# EAGLE schematic axiom_beta_power_board_v1.25.f59751f5 (EAGLE 7.7.0), part 1 of 2
Assembly variants: Beta, Min

## Sheet 1 of 14
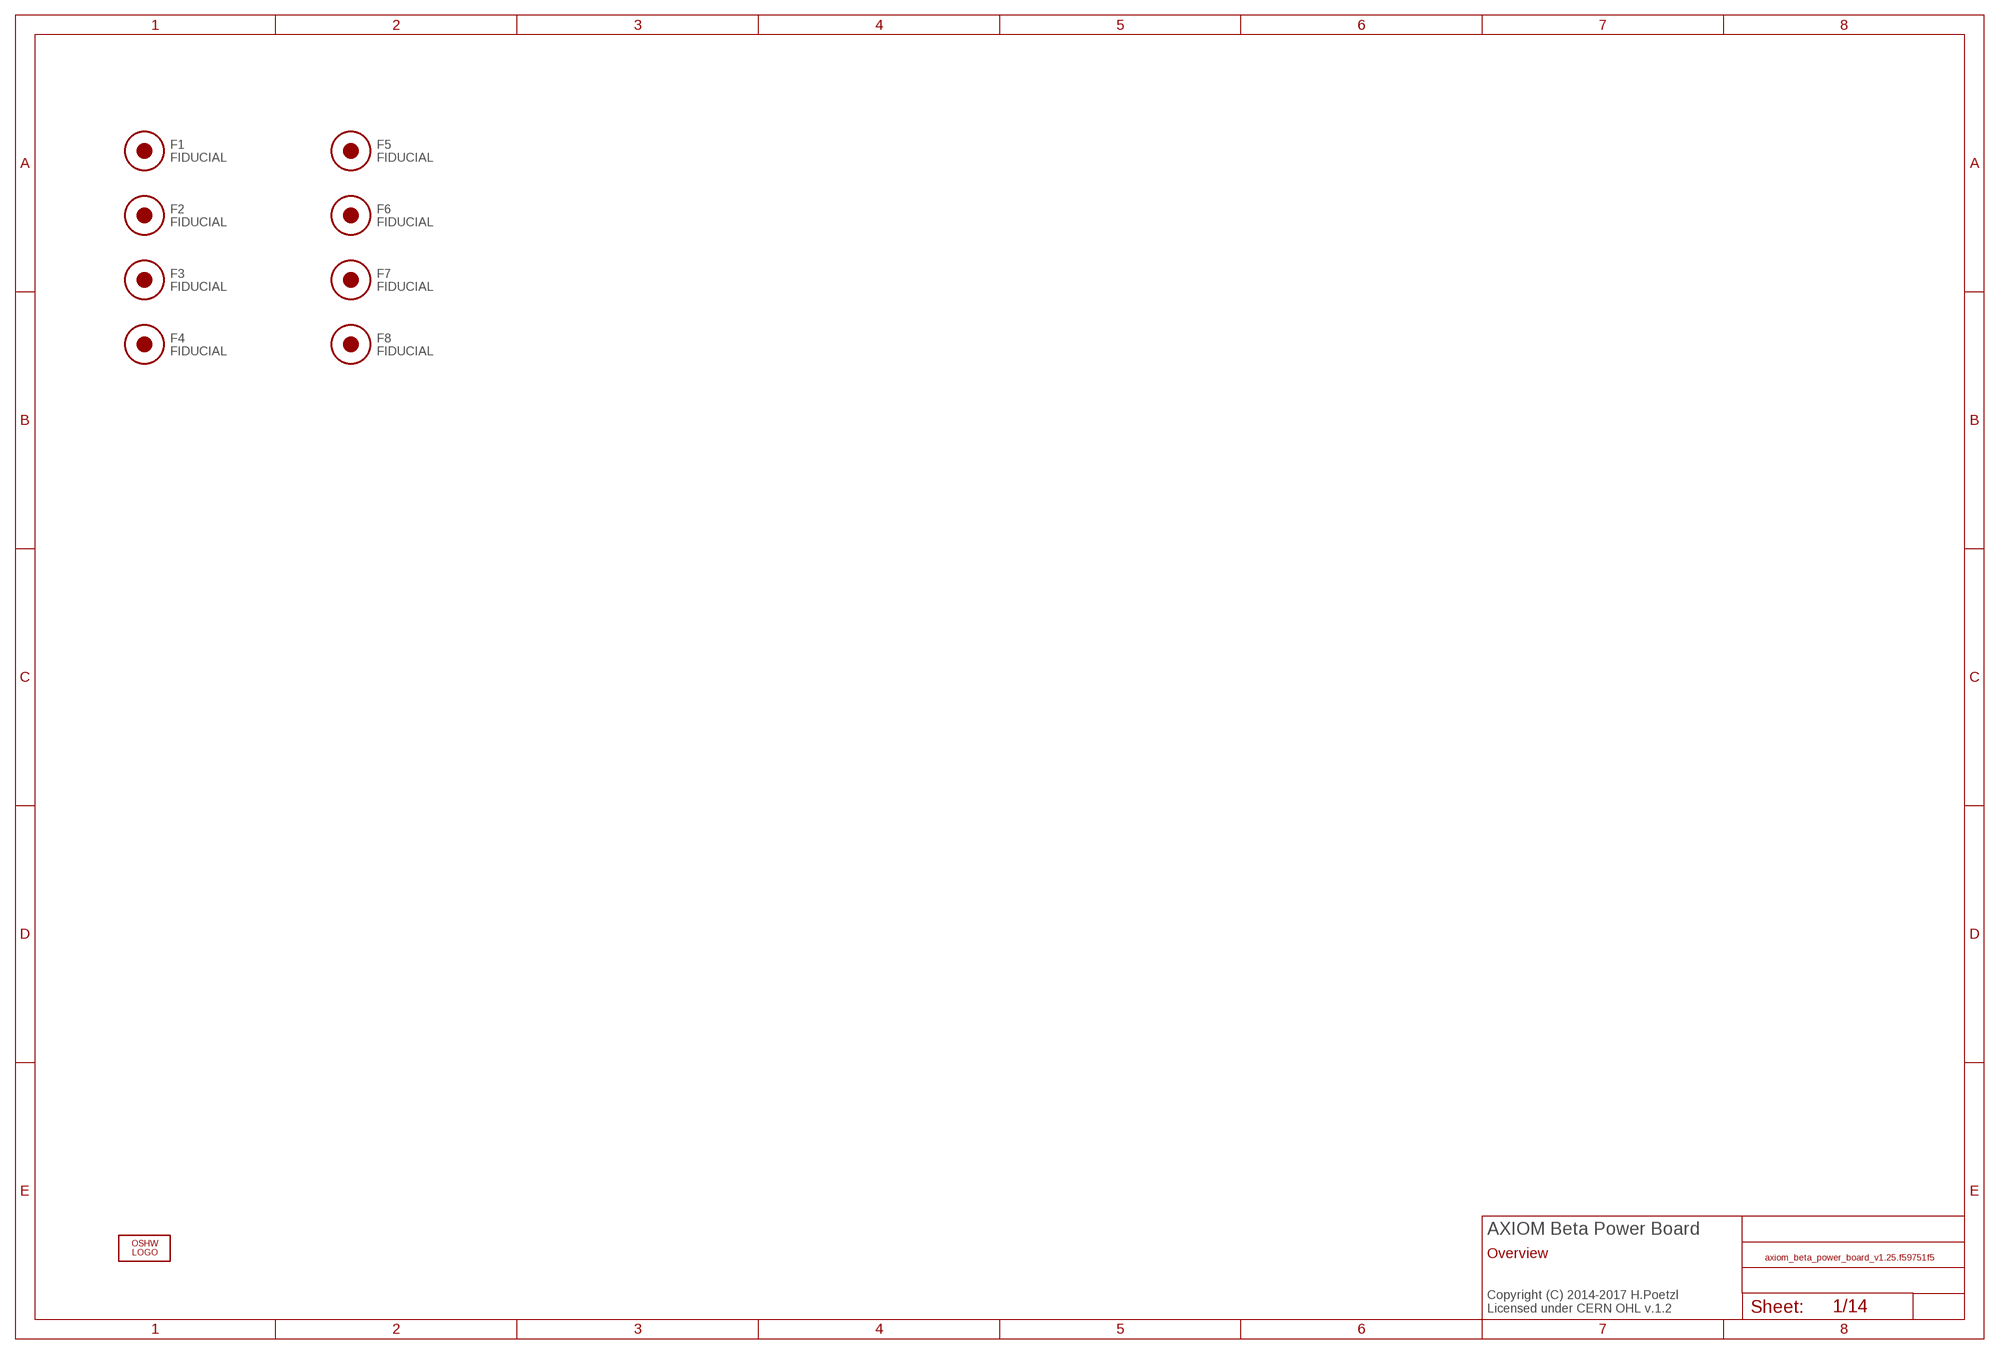
[diagram p0: schematic, sheet 1]

### Parts
F1  FIDUCIAL  [FID_ARROW]
F2  FIDUCIAL  [FID_ARROW]
F3  FIDUCIAL  [FID_ARROW]
F4  FIDUCIAL  [FID_ARROW]
F5  FIDUCIAL  [FID_ARROW]
F6  FIDUCIAL  [FID_ARROW]
F7  FIDUCIAL  [FID_ARROW]
F8  FIDUCIAL  [FID_ARROW]
LOGO2  OSHW_LOGO_FILLX0100-NT  [OSHW_FILLX100_NOTEXT]

### Notes on the sheet
- AXIOM Beta Power Board
- Overview
- Copyright (C) 2014-2017 H.Poetzl
  Licensed under CERN OHL v.1.2

## Sheet 2 of 14
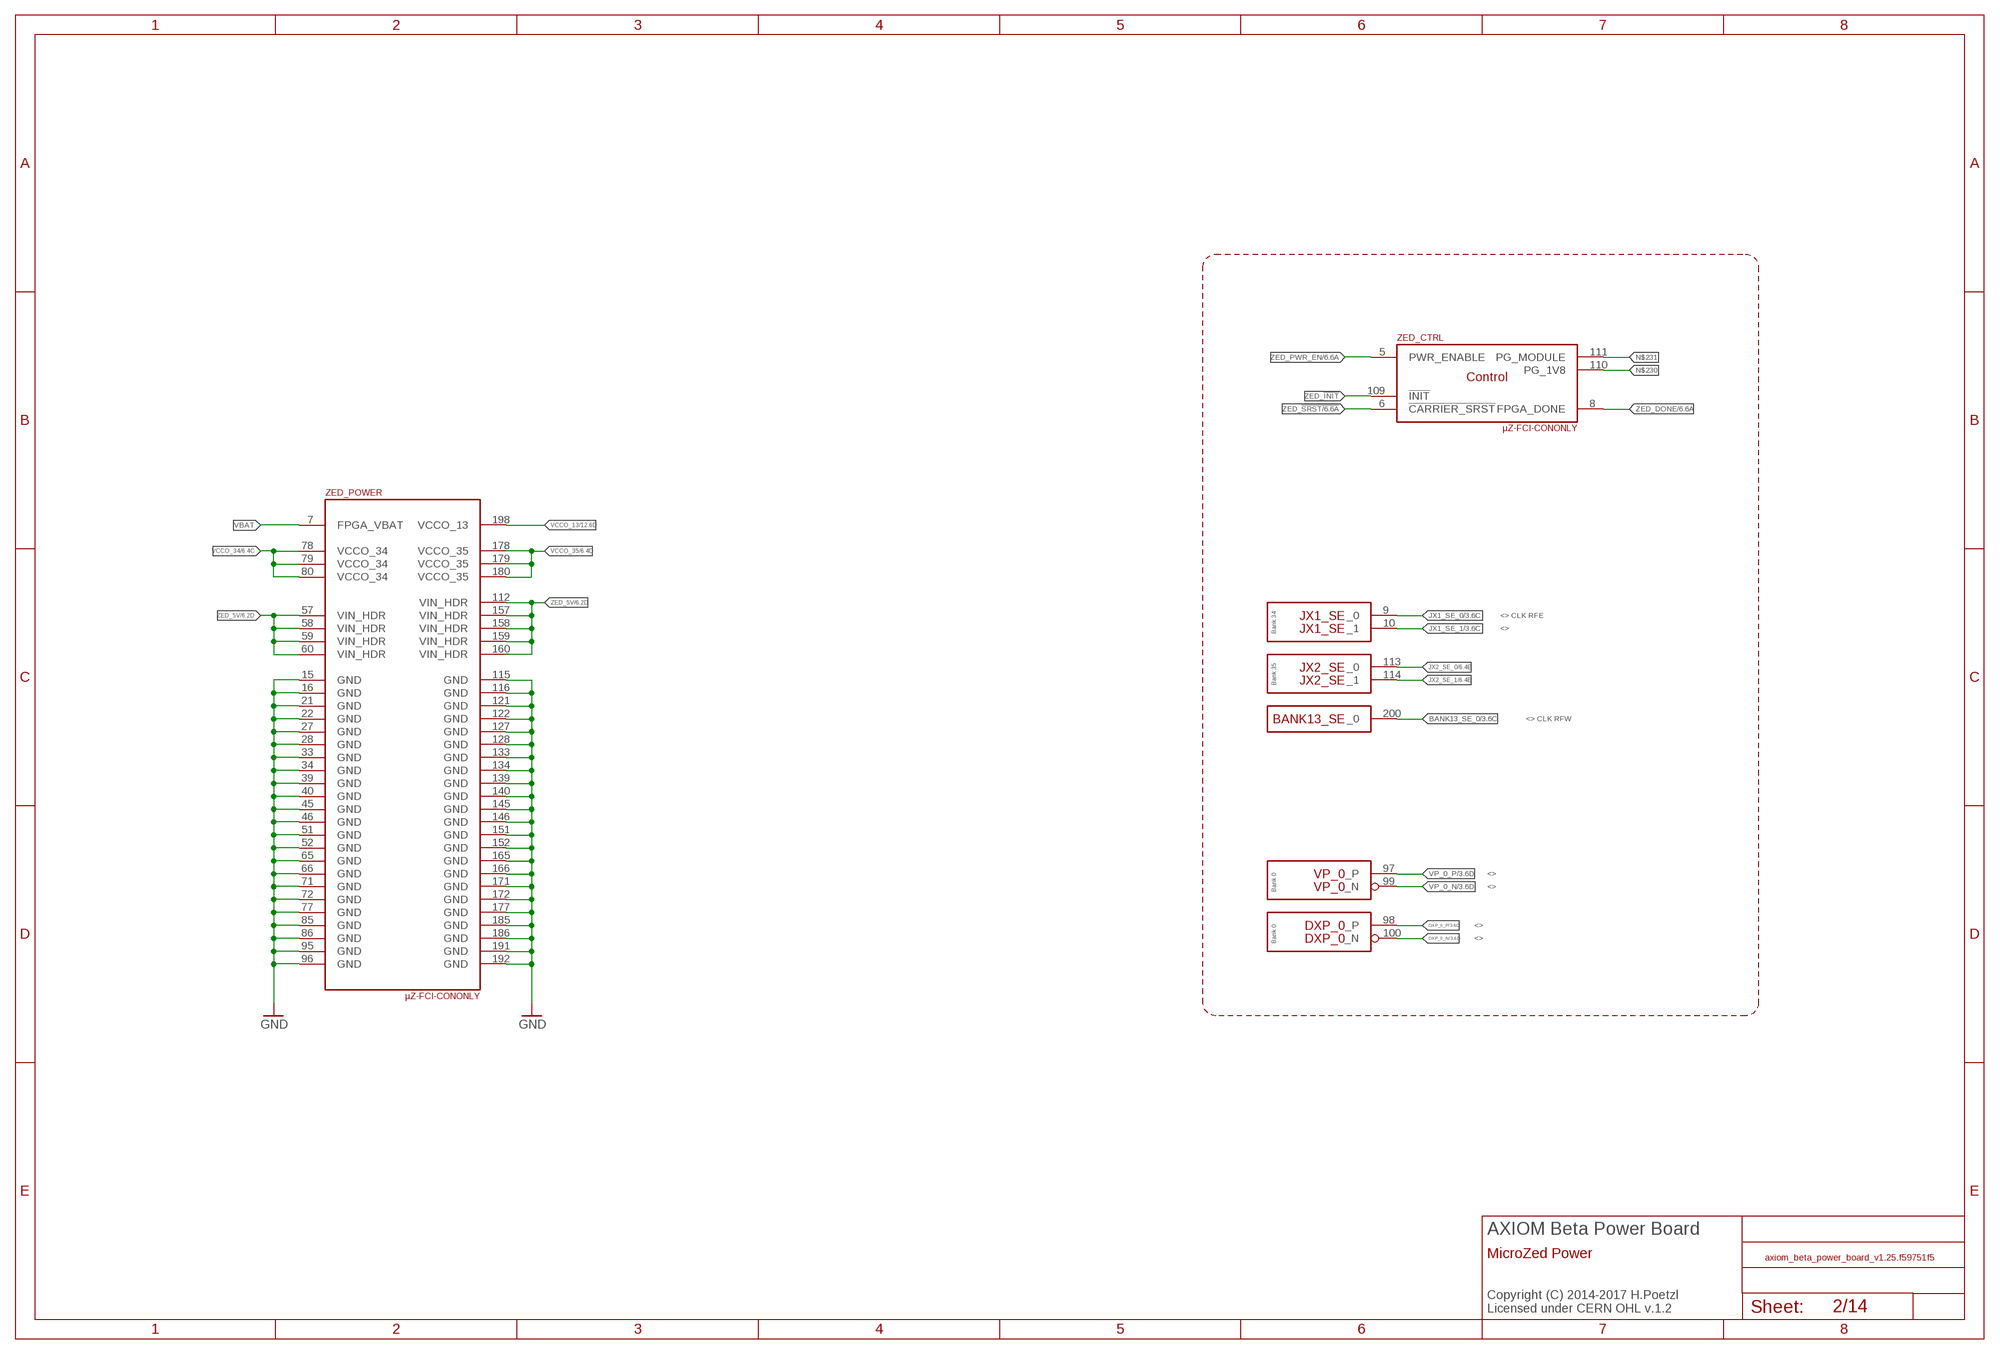
[diagram p1: schematic, sheet 2]

### Parts
ZED  µZ-FCI-CONONLY  [µZ-CONONLY]

### Nets
BANK13_SE_0: ZED.200(BANK13_SE:_0) ; also sheet 3
DXP_0_N: ZED.100(DXP_0:_N) ; also sheet 3
DXP_0_P: ZED.98(DXP_0:_P) ; also sheet 3
GND: ZED.15(_POWER:GND) ZED.16(_POWER:GND) ZED.21(_POWER:GND) ZED.22(_POWER:GND) ZED.27(_POWER:GND) ZED.28(_POWER:GND) ZED.33(_POWER:GND) ZED.34(_POWER:GND) ZED.39(_POWER:GND) ZED.40(_POWER:GND) ZED.45(_POWER:GND) ZED.46(_POWER:GND) ZED.51(_POWER:GND) ZED.52(_POWER:GND) ZED.65(_POWER:GND) ZED.66(_POWER:GND) ZED.71(_POWER:GND) ZED.72(_POWER:GND) ZED.77(_POWER:GND) ZED.85(_POWER:GND) ZED.86(_POWER:GND) ZED.95(_POWER:GND) ZED.96(_POWER:GND) ZED.115(_POWER:GND) ZED.116(_POWER:GND) ZED.121(_POWER:GND) ZED.122(_POWER:GND) ZED.127(_POWER:GND) ZED.128(_POWER:GND) ZED.133(_POWER:GND) ZED.134(_POWER:GND) ZED.139(_POWER:GND) ZED.140(_POWER:GND) ZED.145(_POWER:GND) ZED.146(_POWER:GND) ZED.151(_POWER:GND) ZED.152(_POWER:GND) ZED.165(_POWER:GND) ZED.166(_POWER:GND) ZED.171(_POWER:GND) ZED.172(_POWER:GND) ZED.177(_POWER:GND) ZED.185(_POWER:GND) ZED.186(_POWER:GND) ZED.191(_POWER:GND) ZED.192(_POWER:GND) ; also sheet 3,5,6,7,8,9,10,11,12,13,14
JX1_SE_0: ZED.9(JX1_SE:_0) ; also sheet 3
JX1_SE_1: ZED.10(JX1_SE:_1) ; also sheet 3,6
JX2_SE_0: ZED.113(JX2_SE:_0) ; also sheet 6
JX2_SE_1: ZED.114(JX2_SE:_1) ; also sheet 6
N$230: ZED.110(_CTRL:PG_1V8)
N$231: ZED.111(_CTRL:PG_MODULE)
VBAT: ZED.7(_POWER:FPGA_VBAT)
VCCO_13 [LVDS]: ZED.198(_POWER:VCCO_13) ; also sheet 12
VCCO_34: ZED.78(_POWER:VCCO_34) ZED.79(_POWER:VCCO_34) ZED.80(_POWER:VCCO_34) ; also sheet 6,9,12
VCCO_35: ZED.178(_POWER:VCCO_35) ZED.179(_POWER:VCCO_35) ZED.180(_POWER:VCCO_35) ; also sheet 6,9,12
VP_0_N: ZED.99(VP_0:_N) ; also sheet 3
VP_0_P: ZED.97(VP_0:_P) ; also sheet 3
ZED_5V: ZED.57(_POWER:VIN_HDR) ZED.58(_POWER:VIN_HDR) ZED.59(_POWER:VIN_HDR) ZED.60(_POWER:VIN_HDR) ZED.112(_POWER:VIN_HDR) ZED.157(_POWER:VIN_HDR) ZED.158(_POWER:VIN_HDR) ZED.159(_POWER:VIN_HDR) ZED.160(_POWER:VIN_HDR) ; also sheet 6,9
ZED_!INIT: ZED.109(_CTRL:!INIT)
ZED_!SRST: ZED.6(_CTRL:!CARRIER_SRST) ; also sheet 6
ZED_DONE: ZED.8(_CTRL:FPGA_DONE) ; also sheet 6
ZED_PWR_EN: ZED.5(_CTRL:PWR_ENABLE) ; also sheet 6

### Notes on the sheet
- <> CLK RFE
- <>
- Bank 34
- Bank 35
- <> CLK RFW
- <>
- <>
- Bank 0
- <>
- <>
- Bank 0
- AXIOM Beta Power Board
- MicroZed Power
- Copyright (C) 2014-2017 H.Poetzl
  Licensed under CERN OHL v.1.2

## Sheet 3 of 14
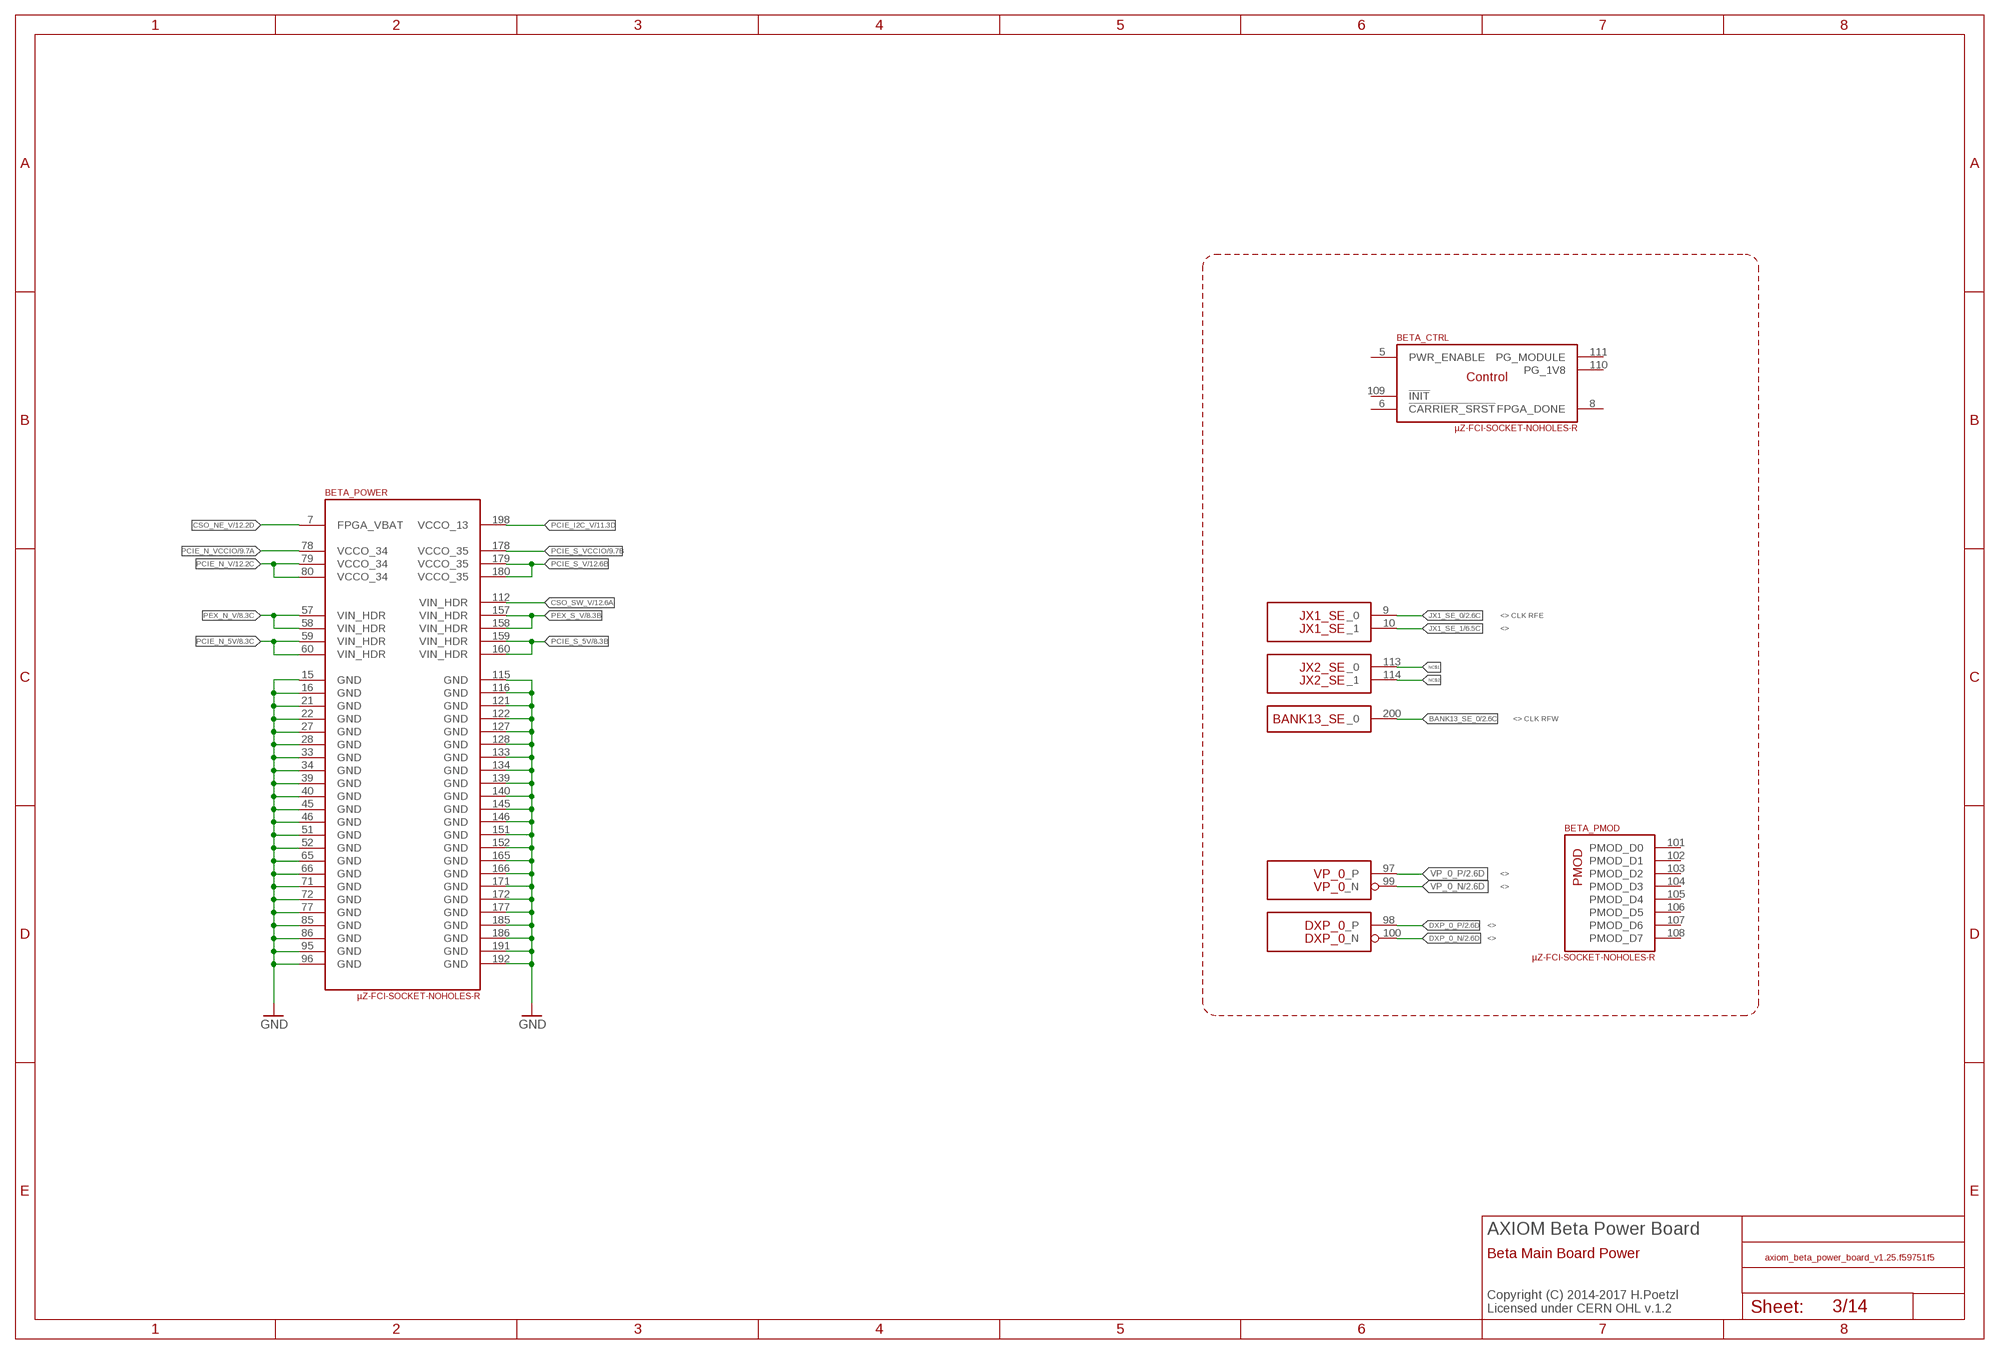
[diagram p2: schematic, sheet 3]

### Parts
BETA  µZ-FCI-SOCKET-NOHOLES-R  [µZ-SOCKET-NOHOLES-R]

### Nets
BANK13_SE_0: BETA.200(BANK13_SE:_0) ; also sheet 2
CSO_NE_V: BETA.7(_POWER:FPGA_VBAT) ; also sheet 12
CSO_SW_V: BETA.112(_POWER:VIN_HDR) ; also sheet 12
DXP_0_N: BETA.100(DXP_0:_N) ; also sheet 2
DXP_0_P: BETA.98(DXP_0:_P) ; also sheet 2
GND: BETA.15(_POWER:GND) BETA.16(_POWER:GND) BETA.21(_POWER:GND) BETA.22(_POWER:GND) BETA.27(_POWER:GND) BETA.28(_POWER:GND) BETA.33(_POWER:GND) BETA.34(_POWER:GND) BETA.39(_POWER:GND) BETA.40(_POWER:GND) BETA.45(_POWER:GND) BETA.46(_POWER:GND) BETA.51(_POWER:GND) BETA.52(_POWER:GND) BETA.65(_POWER:GND) BETA.66(_POWER:GND) BETA.71(_POWER:GND) BETA.72(_POWER:GND) BETA.77(_POWER:GND) BETA.85(_POWER:GND) BETA.86(_POWER:GND) BETA.95(_POWER:GND) BETA.96(_POWER:GND) BETA.115(_POWER:GND) BETA.116(_POWER:GND) BETA.121(_POWER:GND) BETA.122(_POWER:GND) BETA.127(_POWER:GND) BETA.128(_POWER:GND) BETA.133(_POWER:GND) BETA.134(_POWER:GND) BETA.139(_POWER:GND) BETA.140(_POWER:GND) BETA.145(_POWER:GND) BETA.146(_POWER:GND) BETA.151(_POWER:GND) BETA.152(_POWER:GND) BETA.165(_POWER:GND) BETA.166(_POWER:GND) BETA.171(_POWER:GND) BETA.172(_POWER:GND) BETA.177(_POWER:GND) BETA.185(_POWER:GND) BETA.186(_POWER:GND) BETA.191(_POWER:GND) BETA.192(_POWER:GND) ; also sheet 2,5,6,7,8,9,10,11,12,13,14
JX1_SE_0: BETA.9(JX1_SE:_0) ; also sheet 2
JX1_SE_1: BETA.10(JX1_SE:_1) ; also sheet 2,6
NC$1 [LVDS]: BETA.113(JX2_SE:_0)
NC$2 [LVDS]: BETA.114(JX2_SE:_1)
PCIE_I2C_V: BETA.198(_POWER:VCCO_13) ; also sheet 11
PCIE_N_5V: BETA.59(_POWER:VIN_HDR) BETA.60(_POWER:VIN_HDR) ; also sheet 8
PCIE_N_V: BETA.79(_POWER:VCCO_34) BETA.80(_POWER:VCCO_34) ; also sheet 12
PCIE_N_VCCIO: BETA.78(_POWER:VCCO_34) ; also sheet 9
PCIE_S_5V: BETA.159(_POWER:VIN_HDR) BETA.160(_POWER:VIN_HDR) ; also sheet 8
PCIE_S_V: BETA.179(_POWER:VCCO_35) BETA.180(_POWER:VCCO_35) ; also sheet 12
PCIE_S_VCCIO: BETA.178(_POWER:VCCO_35) ; also sheet 9
PEX_N_V: BETA.57(_POWER:VIN_HDR) BETA.58(_POWER:VIN_HDR) ; also sheet 8
PEX_S_V: BETA.157(_POWER:VIN_HDR) BETA.158(_POWER:VIN_HDR) ; also sheet 8
VP_0_N: BETA.99(VP_0:_N) ; also sheet 2
VP_0_P: BETA.97(VP_0:_P) ; also sheet 2
Unconnected: BETA.1(_JTAG:TCK) BETA.2(_JTAG:TMS) BETA.3(_JTAG:TDO) BETA.4(_JTAG:TDI) BETA.5(_CTRL:PWR_ENABLE) BETA.6(_CTRL:!CARRIER_SRST) BETA.8(_CTRL:FPGA_DONE) BETA.101(_PMOD:PMOD_D0) BETA.102(_PMOD:PMOD_D1) BETA.103(_PMOD:PMOD_D2) BETA.104(_PMOD:PMOD_D3) BETA.105(_PMOD:PMOD_D4) BETA.106(_PMOD:PMOD_D5) BETA.107(_PMOD:PMOD_D6) BETA.108(_PMOD:PMOD_D7) BETA.109(_CTRL:!INIT) BETA.110(_CTRL:PG_1V8) BETA.111(_CTRL:PG_MODULE)

### Notes on the sheet
- <> CLK RFE
- <>
- <> CLK RFW
- <>
- <>
- <>
- <>
- AXIOM Beta Power Board
- Beta Main Board Power
- Copyright (C) 2014-2017 H.Poetzl
  Licensed under CERN OHL v.1.2

## Sheet 4 of 14
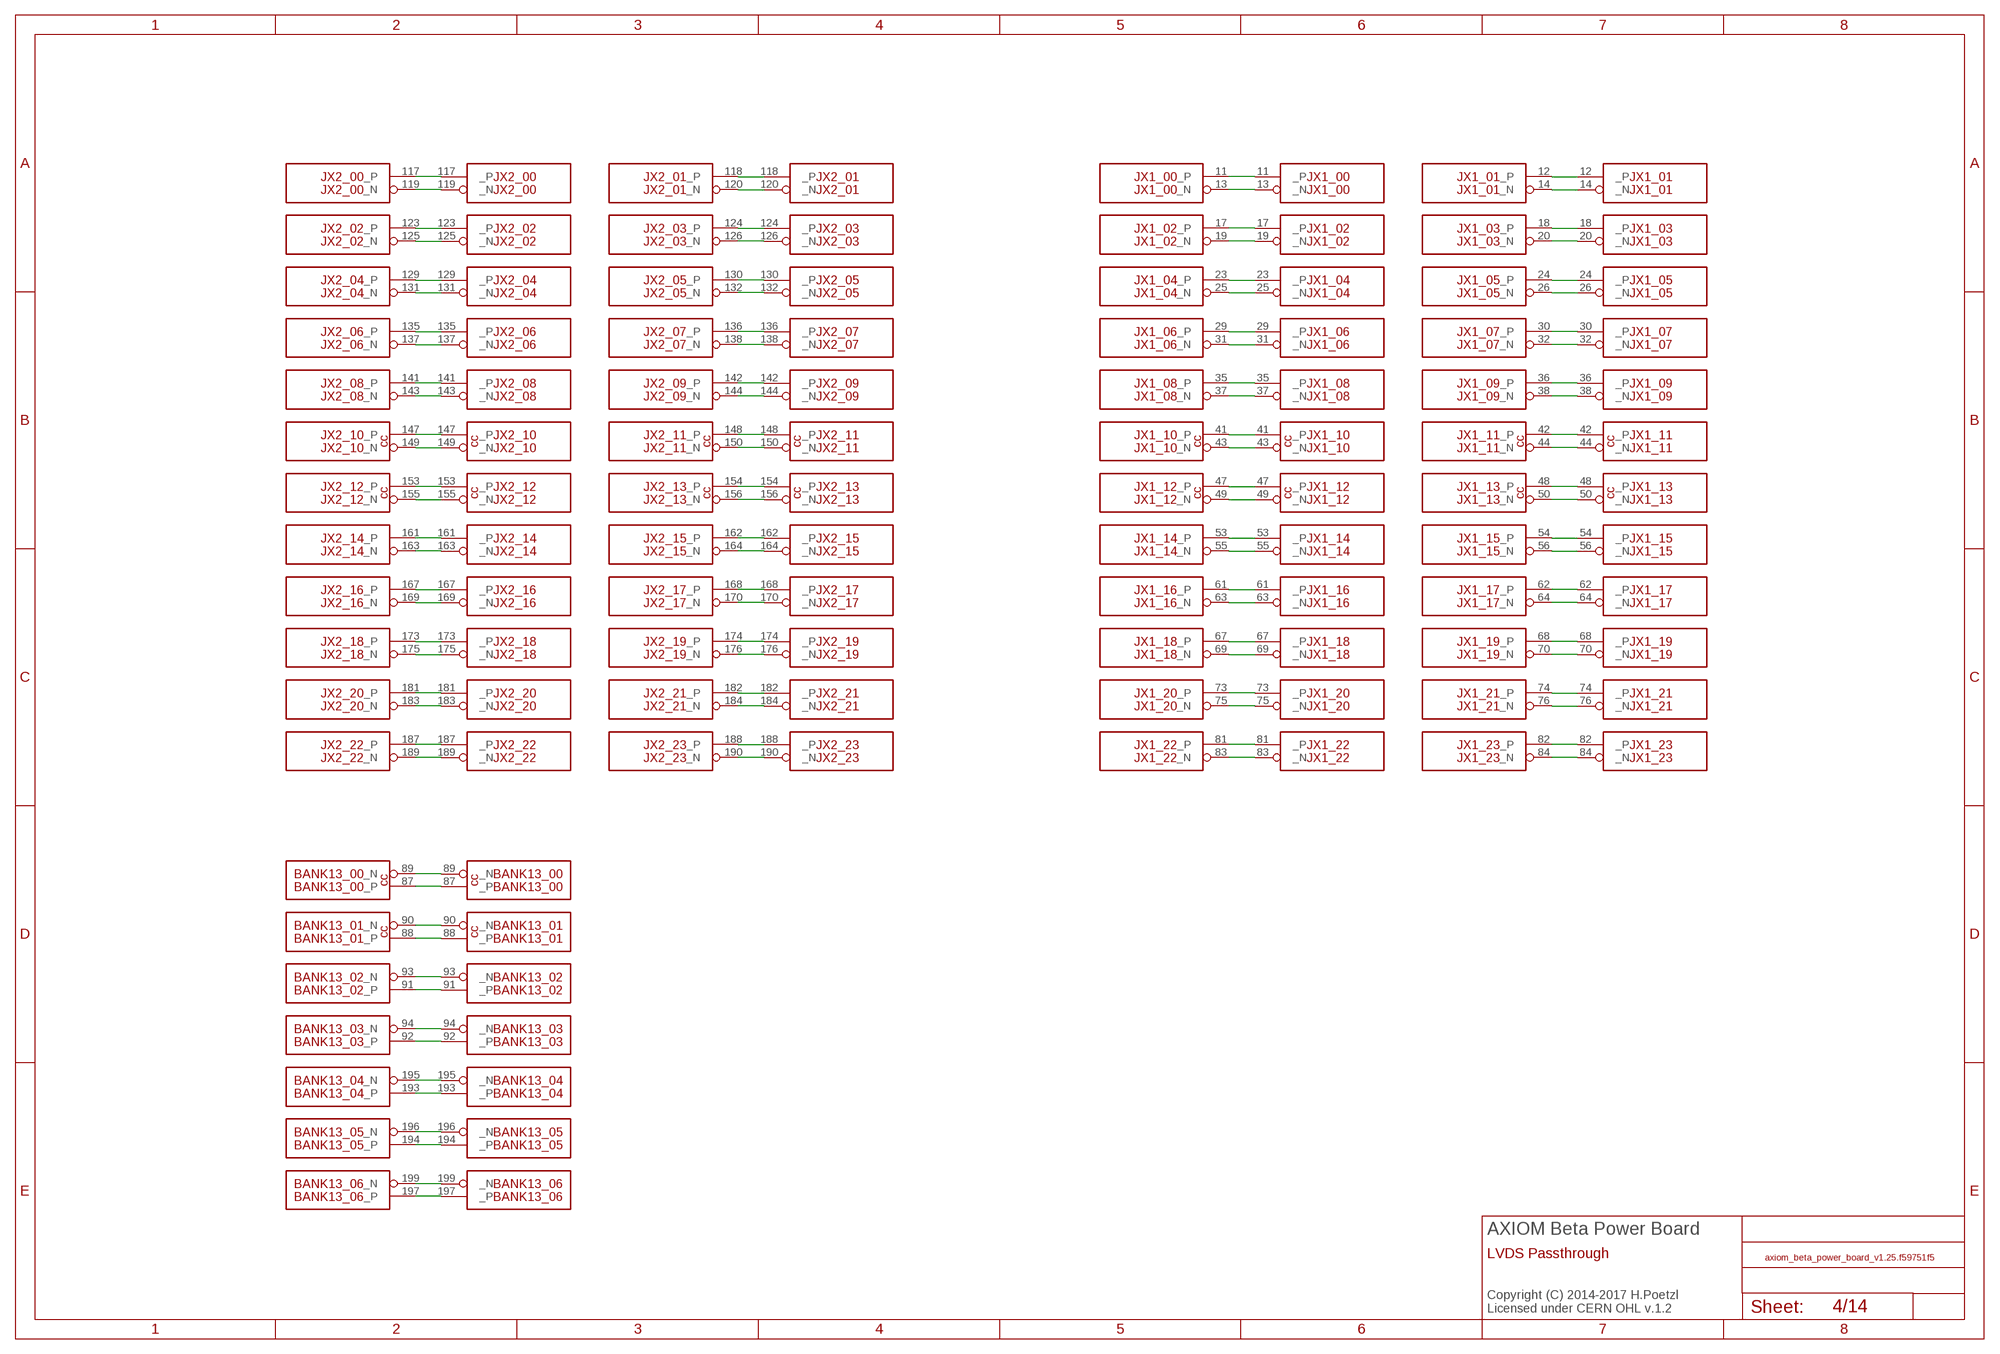
[diagram p3: schematic, sheet 4]

### Nets
BANK13_00_N [LVDS]: BETA.89(BANK13_00:_N) ZED.89(BANK13_00:_N)
BANK13_00_P [LVDS]: BETA.87(BANK13_00:_P) ZED.87(BANK13_00:_P)
BANK13_01_N [LVDS]: BETA.90(BANK13_01:_N) ZED.90(BANK13_01:_N)
BANK13_01_P [LVDS]: BETA.88(BANK13_01:_P) ZED.88(BANK13_01:_P)
BANK13_02_N [LVDS]: BETA.93(BANK13_02:_N) ZED.93(BANK13_02:_N)
BANK13_02_P [LVDS]: BETA.91(BANK13_02:_P) ZED.91(BANK13_02:_P)
BANK13_03_N [LVDS]: BETA.94(BANK13_03:_N) ZED.94(BANK13_03:_N)
BANK13_03_P [LVDS]: BETA.92(BANK13_03:_P) ZED.92(BANK13_03:_P)
BANK13_04_N [LVDS]: BETA.195(BANK13_04:_N) ZED.195(BANK13_04:_N)
BANK13_04_P [LVDS]: BETA.193(BANK13_04:_P) ZED.193(BANK13_04:_P)
BANK13_05_N: BETA.196(BANK13_05:_N) ZED.196(BANK13_05:_N)
BANK13_05_P: BETA.194(BANK13_05:_P) ZED.194(BANK13_05:_P)
BANK13_06_N [LVDS]: BETA.199(BANK13_06:_N) ZED.199(BANK13_06:_N)
BANK13_06_P [LVDS]: BETA.197(BANK13_06:_P) ZED.197(BANK13_06:_P)
JX1_00_N [LVDS]: BETA.13(JX1_00:_N) ZED.13(JX1_00:_N)
JX1_00_P [LVDS]: BETA.11(JX1_00:_P) ZED.11(JX1_00:_P)
JX1_01_N [LVDS]: BETA.14(JX1_01:_N) ZED.14(JX1_01:_N)
JX1_01_P [LVDS]: BETA.12(JX1_01:_P) ZED.12(JX1_01:_P)
JX1_02_N [LVDS]: BETA.19(JX1_02:_N) ZED.19(JX1_02:_N)
JX1_02_P [LVDS]: BETA.17(JX1_02:_P) ZED.17(JX1_02:_P)
JX1_03_N [LVDS]: BETA.20(JX1_03:_N) ZED.20(JX1_03:_N)
JX1_03_P [LVDS]: BETA.18(JX1_03:_P) ZED.18(JX1_03:_P)
JX1_04_N [LVDS]: BETA.25(JX1_04:_N) ZED.25(JX1_04:_N)
JX1_04_P [LVDS]: BETA.23(JX1_04:_P) ZED.23(JX1_04:_P)
JX1_05_N: BETA.26(JX1_05:_N) ZED.26(JX1_05:_N)
JX1_05_P: BETA.24(JX1_05:_P) ZED.24(JX1_05:_P)
JX1_06_N [LVDS]: BETA.31(JX1_06:_N) ZED.31(JX1_06:_N)
JX1_06_P [LVDS]: BETA.29(JX1_06:_P) ZED.29(JX1_06:_P)
JX1_07_N [LVDS]: BETA.32(JX1_07:_N) ZED.32(JX1_07:_N)
JX1_07_P [LVDS]: BETA.30(JX1_07:_P) ZED.30(JX1_07:_P)
JX1_08_N: BETA.37(JX1_08:_N) ZED.37(JX1_08:_N)
JX1_08_P: BETA.35(JX1_08:_P) ZED.35(JX1_08:_P)
JX1_09_N [LVDS]: BETA.38(JX1_09:_N) ZED.38(JX1_09:_N)
JX1_09_P [LVDS]: BETA.36(JX1_09:_P) ZED.36(JX1_09:_P)
JX1_10_N [LVDS]: BETA.43(JX1_10:_N) ZED.43(JX1_10:_N)
JX1_10_P [LVDS]: BETA.41(JX1_10:_P) ZED.41(JX1_10:_P)
JX1_11_N [LVDS]: BETA.44(JX1_11:_N) ZED.44(JX1_11:_N)
JX1_11_P [LVDS]: BETA.42(JX1_11:_P) ZED.42(JX1_11:_P)
JX1_12_N [LVDS]: BETA.49(JX1_12:_N) ZED.49(JX1_12:_N)
JX1_12_P [LVDS]: BETA.47(JX1_12:_P) ZED.47(JX1_12:_P)
JX1_13_N [LVDS]: BETA.50(JX1_13:_N) ZED.50(JX1_13:_N)
JX1_13_P [LVDS]: BETA.48(JX1_13:_P) ZED.48(JX1_13:_P)
JX1_14_N [LVDS]: BETA.55(JX1_14:_N) ZED.55(JX1_14:_N)
JX1_14_P [LVDS]: BETA.53(JX1_14:_P) ZED.53(JX1_14:_P)
JX1_15_N: BETA.56(JX1_15:_N) ZED.56(JX1_15:_N)
JX1_15_P: BETA.54(JX1_15:_P) ZED.54(JX1_15:_P)
JX1_16_N [LVDS]: BETA.63(JX1_16:_N) ZED.63(JX1_16:_N)
JX1_16_P [LVDS]: BETA.61(JX1_16:_P) ZED.61(JX1_16:_P)
JX1_17_N [LVDS]: BETA.64(JX1_17:_N) ZED.64(JX1_17:_N)
JX1_17_P [LVDS]: BETA.62(JX1_17:_P) ZED.62(JX1_17:_P)
JX1_18_N [LVDS]: BETA.69(JX1_18:_N) ZED.69(JX1_18:_N)
JX1_18_P [LVDS]: BETA.67(JX1_18:_P) ZED.67(JX1_18:_P)
JX1_19_N [LVDS]: BETA.70(JX1_19:_N) ZED.70(JX1_19:_N)
JX1_19_P [LVDS]: BETA.68(JX1_19:_P) ZED.68(JX1_19:_P)
JX1_20_N: BETA.75(JX1_20:_N) ZED.75(JX1_20:_N)
JX1_20_P: BETA.73(JX1_20:_P) ZED.73(JX1_20:_P)
JX1_21_N: BETA.76(JX1_21:_N) ZED.76(JX1_21:_N)
JX1_21_P: BETA.74(JX1_21:_P) ZED.74(JX1_21:_P)
JX1_22_N: BETA.83(JX1_22:_N) ZED.83(JX1_22:_N)
JX1_22_P: BETA.81(JX1_22:_P) ZED.81(JX1_22:_P)
JX1_23_N [LVDS]: BETA.84(JX1_23:_N) ZED.84(JX1_23:_N)
JX1_23_P [LVDS]: BETA.82(JX1_23:_P) ZED.82(JX1_23:_P)
JX2_00_N [LVDS]: BETA.119(JX2_00:_N) ZED.119(JX2_00:_N)
JX2_00_P [LVDS]: BETA.117(JX2_00:_P) ZED.117(JX2_00:_P)
JX2_01_N [LVDS]: BETA.120(JX2_01:_N) ZED.120(JX2_01:_N)
JX2_01_P [LVDS]: BETA.118(JX2_01:_P) ZED.118(JX2_01:_P)
JX2_02_N [LVDS]: BETA.125(JX2_02:_N) ZED.125(JX2_02:_N)
JX2_02_P [LVDS]: BETA.123(JX2_02:_P) ZED.123(JX2_02:_P)
JX2_03_N [LVDS]: BETA.126(JX2_03:_N) ZED.126(JX2_03:_N)
JX2_03_P [LVDS]: BETA.124(JX2_03:_P) ZED.124(JX2_03:_P)
JX2_04_N [LVDS]: BETA.131(JX2_04:_N) ZED.131(JX2_04:_N)
JX2_04_P [LVDS]: BETA.129(JX2_04:_P) ZED.129(JX2_04:_P)
JX2_05_N [LVDS]: BETA.132(JX2_05:_N) ZED.132(JX2_05:_N)
JX2_05_P [LVDS]: BETA.130(JX2_05:_P) ZED.130(JX2_05:_P)
JX2_06_N [LVDS]: BETA.137(JX2_06:_N) ZED.137(JX2_06:_N)
JX2_06_P [LVDS]: BETA.135(JX2_06:_P) ZED.135(JX2_06:_P)
JX2_07_N [LVDS]: BETA.138(JX2_07:_N) ZED.138(JX2_07:_N)
JX2_07_P [LVDS]: BETA.136(JX2_07:_P) ZED.136(JX2_07:_P)
JX2_08_N [LVDS]: BETA.143(JX2_08:_N) ZED.143(JX2_08:_N)
JX2_08_P [LVDS]: BETA.141(JX2_08:_P) ZED.141(JX2_08:_P)
JX2_09_N [LVDS]: BETA.144(JX2_09:_N) ZED.144(JX2_09:_N)
JX2_09_P [LVDS]: BETA.142(JX2_09:_P) ZED.142(JX2_09:_P)
JX2_10_N [LVDS]: BETA.149(JX2_10:_N) ZED.149(JX2_10:_N)
JX2_10_P [LVDS]: BETA.147(JX2_10:_P) ZED.147(JX2_10:_P)
JX2_11_N [LVDS]: BETA.150(JX2_11:_N) ZED.150(JX2_11:_N)
JX2_11_P [LVDS]: BETA.148(JX2_11:_P) ZED.148(JX2_11:_P)
JX2_12_N [LVDS]: BETA.155(JX2_12:_N) ZED.155(JX2_12:_N)
JX2_12_P [LVDS]: BETA.153(JX2_12:_P) ZED.153(JX2_12:_P)
JX2_13_N [LVDS]: BETA.156(JX2_13:_N) ZED.156(JX2_13:_N)
JX2_13_P [LVDS]: BETA.154(JX2_13:_P) ZED.154(JX2_13:_P)
JX2_14_N: BETA.163(JX2_14:_N) ZED.163(JX2_14:_N)
JX2_14_P: BETA.161(JX2_14:_P) ZED.161(JX2_14:_P)
JX2_15_N [LVDS]: BETA.164(JX2_15:_N) ZED.164(JX2_15:_N)
JX2_15_P [LVDS]: BETA.162(JX2_15:_P) ZED.162(JX2_15:_P)
JX2_16_N [LVDS]: BETA.169(JX2_16:_N) ZED.169(JX2_16:_N)
JX2_16_P [LVDS]: BETA.167(JX2_16:_P) ZED.167(JX2_16:_P)
JX2_17_N [LVDS]: BETA.170(JX2_17:_N) ZED.170(JX2_17:_N)
JX2_17_P [LVDS]: BETA.168(JX2_17:_P) ZED.168(JX2_17:_P)
JX2_18_N [LVDS]: BETA.175(JX2_18:_N) ZED.175(JX2_18:_N)
JX2_18_P [LVDS]: BETA.173(JX2_18:_P) ZED.173(JX2_18:_P)
JX2_19_N [LVDS]: BETA.176(JX2_19:_N) ZED.176(JX2_19:_N)
JX2_19_P [LVDS]: BETA.174(JX2_19:_P) ZED.174(JX2_19:_P)
JX2_20_N [LVDS]: BETA.183(JX2_20:_N) ZED.183(JX2_20:_N)
JX2_20_P [LVDS]: BETA.181(JX2_20:_P) ZED.181(JX2_20:_P)
JX2_21_N [LVDS]: BETA.184(JX2_21:_N) ZED.184(JX2_21:_N)
JX2_21_P [LVDS]: BETA.182(JX2_21:_P) ZED.182(JX2_21:_P)
JX2_22_N: BETA.189(JX2_22:_N) ZED.189(JX2_22:_N)
JX2_22_P: BETA.187(JX2_22:_P) ZED.187(JX2_22:_P)
JX2_23_N [LVDS]: BETA.190(JX2_23:_N) ZED.190(JX2_23:_N)
JX2_23_P [LVDS]: BETA.188(JX2_23:_P) ZED.188(JX2_23:_P)

### Notes on the sheet
- AXIOM Beta Power Board
- LVDS Passthrough
- Copyright (C) 2014-2017 H.Poetzl
  Licensed under CERN OHL v.1.2

## Sheet 5 of 14
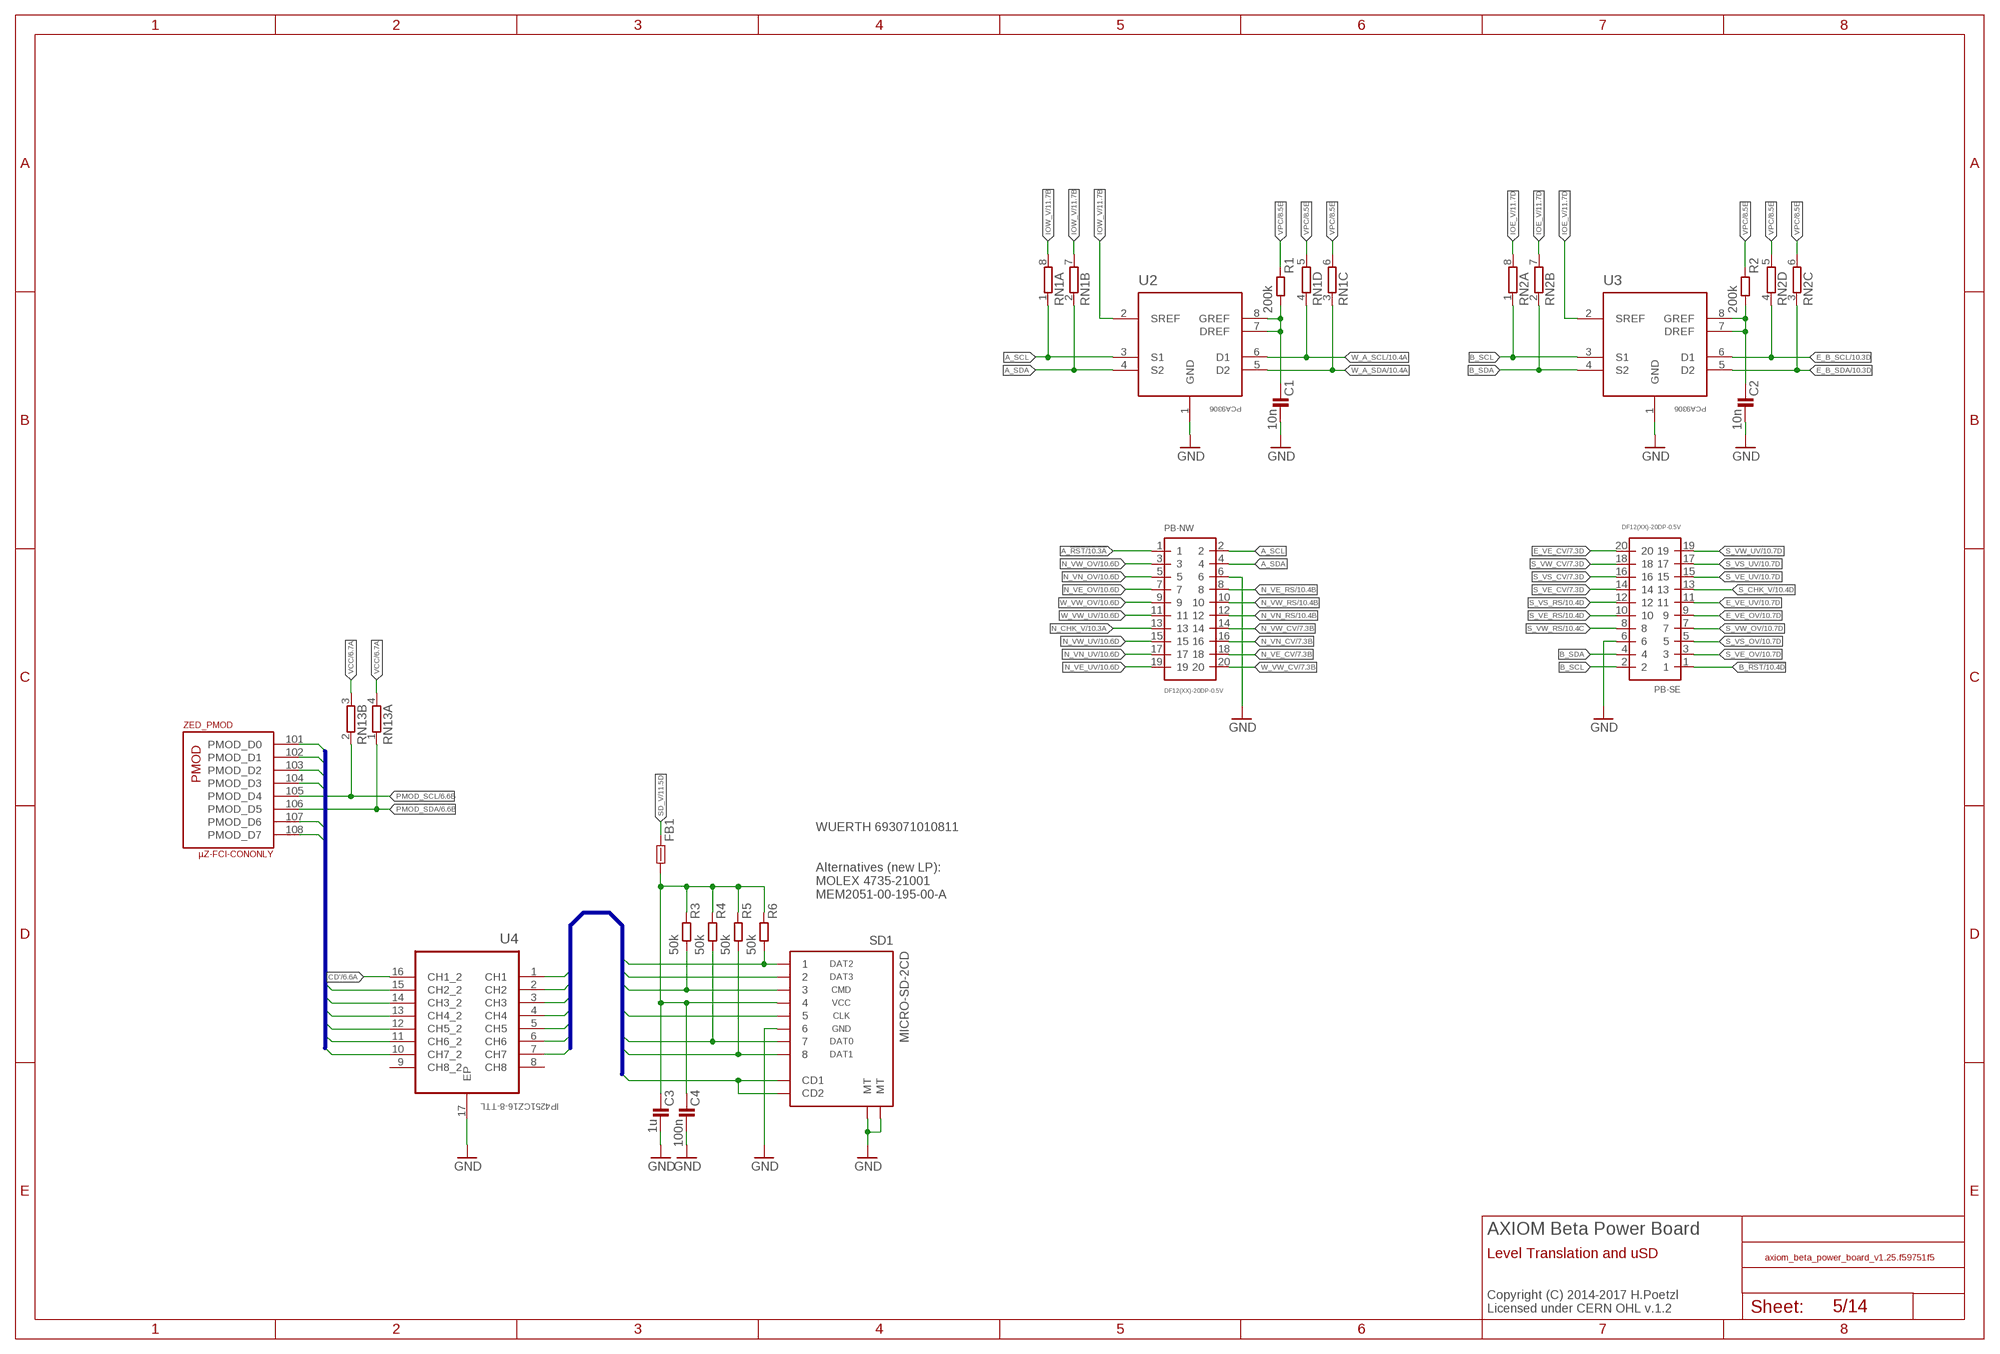
[diagram p4: schematic, sheet 5]

### Parts
C1  10n  C0402-C  [0402-C]
C2  10n  C0402-C  [0402-C]
C3  1u  C0402-C  [0402-C]
C4  100n  C0402-C  [0402-C]
FB1  FB0402-C  [0402-C]
PB-NW  DF12(XX)-20DP-0.5V  [DF12(XX)-20DP-0.5V]
PB-SE  DF12(XX)-20DP-0.5V  [DF12(XX)-20DP-0.5V]
R1  200k  R0402-C  [0402-C]
R2  200k  R0402-C  [0402-C]
R3  50k  R0402-C  [0402-C]  (not fitted in variant Min)
R4  50k  R0402-C  [0402-C]  (not fitted in variant Min)
R5  50k  R0402-C  [0402-C]  (not fitted in variant Min)
R6  50k  R0402-C  [0402-C]  (not fitted in variant Min)
RN1  4R-N0402ARV341  [4X0402ARV341]
RN2  4R-N0402ARV341  [4X0402ARV341]
RN13  2R-NEXB24V  [EXB24V]
SD1  MICRO-SD-2CD  [TF-MICRO-SD_PP2]
U2  PCA9306  [UDFN-8]
U3  PCA9306  [UDFN-8]
U4  IP4251CZ16-8-TTL  [SON40P135X330X55-17N]

### Nets
A_!RST: PB-NW.1 ; also sheet 10
A_SCL: PB-NW.2 RN1.1 U2.3(S1)
A_SDA: PB-NW.4 RN1.2 U2.4(S2)
B_!RST: PB-SE.1 ; also sheet 10
B_SCL: PB-SE.2 RN2.1 U3.3(S1)
B_SDA: PB-SE.4 RN2.2 U3.4(S2)
CD: SD1.CD1 SD1.CD2 U4.1(CH1)
CD': U4.16(CH1_2) ; also sheet 6
CLK: SD1.5 U4.5(CH5)
CMD: R3.2 SD1.3 U4.4(CH4)
DAT0: R4.2 SD1.7 U4.6(CH6)
DAT1: R5.2 SD1.8 U4.7(CH7)
DAT2: R6.2 SD1.1 U4.2(CH2)
DAT3: SD1.2 U4.3(CH3)
E_B_SCL: RN2.4 U3.6(D1) ; also sheet 10
E_B_SDA: RN2.3 U3.5(D2) ; also sheet 10
E_VE_CV: PB-SE.20 ; also sheet 7
E_VE_OV: PB-SE.9 ; also sheet 10
E_VE_UV: PB-SE.11 ; also sheet 10
GND: C1.2 C2.2 C3.2 C4.2 PB-NW.6 PB-SE.6 SD1.6 SD1.MT1(MT) SD1.MT2(MT) U2.1(GND) U3.1(GND) U4.17(EP) ; also sheet 2,3,6,7,8,9,10,11,12,13,14
IOE_V: RN2.7 RN2.8 U3.2(SREF) ; also sheet 11,14
IOW_V: RN1.7 RN1.8 U2.2(SREF) ; also sheet 11,13
N$3: C3.1 C4.1 FB1.2 R3.1 R4.1 R5.1 R6.1 SD1.4
N$32: C1.1 R1.2 U2.7(DREF) U2.8(GREF)
N$33: C2.1 R2.2 U3.7(DREF) U3.8(GREF)
N_CHK_V: PB-NW.13 ; also sheet 10,11
N_VE_CV: PB-NW.18 ; also sheet 7
N_VE_OV: PB-NW.7 ; also sheet 10
N_VE_RS: PB-NW.8 ; also sheet 10
N_VE_UV: PB-NW.19 ; also sheet 10
N_VN_CV: PB-NW.16 ; also sheet 7
N_VN_OV: PB-NW.5 ; also sheet 10
N_VN_RS: PB-NW.12 ; also sheet 10
N_VN_UV: PB-NW.17 ; also sheet 10
N_VW_CV: PB-NW.14 ; also sheet 7
N_VW_OV: PB-NW.3 ; also sheet 10
N_VW_RS: PB-NW.10 ; also sheet 10
N_VW_UV: PB-NW.15 ; also sheet 10
PMOD_D0: U4.10(CH7_2) ZED.101(_PMOD:PMOD_D0)
PMOD_D1: U4.11(CH6_2) ZED.102(_PMOD:PMOD_D1)
PMOD_D2: U4.13(CH4_2) ZED.103(_PMOD:PMOD_D2)
PMOD_D3: U4.12(CH5_2) ZED.104(_PMOD:PMOD_D3)
PMOD_D6: U4.15(CH2_2) ZED.107(_PMOD:PMOD_D6)
PMOD_D7: U4.14(CH3_2) ZED.108(_PMOD:PMOD_D7)
PMOD_SCL: RN13.2 ZED.105(_PMOD:PMOD_D4) ; also sheet 6
PMOD_SDA: RN13.1 ZED.106(_PMOD:PMOD_D5) ; also sheet 6
S_CHK_V: PB-SE.13 ; also sheet 10,11
S_VE_CV: PB-SE.14 ; also sheet 7
S_VE_OV: PB-SE.3 ; also sheet 10
S_VE_RS: PB-SE.10 ; also sheet 10
S_VE_UV: PB-SE.15 ; also sheet 10
S_VS_CV: PB-SE.16 ; also sheet 7
S_VS_OV: PB-SE.5 ; also sheet 10
S_VS_RS: PB-SE.12 ; also sheet 10
S_VS_UV: PB-SE.17 ; also sheet 10
S_VW_CV: PB-SE.18 ; also sheet 7
S_VW_OV: PB-SE.7 ; also sheet 10
S_VW_RS: PB-SE.8 ; also sheet 10
S_VW_UV: PB-SE.19 ; also sheet 10
SD_V: FB1.1 ; also sheet 11
VCC: RN13.3 RN13.4 ; also sheet 6,11
VPC: R1.1 R2.1 RN1.5 RN1.6 RN2.5 RN2.6 ; also sheet 8,9,10
W_A_SCL: RN1.4 U2.6(D1) ; also sheet 10
W_A_SDA: RN1.3 U2.5(D2) ; also sheet 10
W_VW_CV: PB-NW.20 ; also sheet 7
W_VW_OV: PB-NW.9 ; also sheet 10
W_VW_UV: PB-NW.11 ; also sheet 10
Unconnected: U4.8(CH8) U4.9(CH8_2)

### Buses
PMOD_D[0..7]
CMD,CLK,DAT[0..3],CD

### Notes on the sheet
- WUERTH 693071010811
  
  
  Alternatives (new LP):
  MOLEX 4735-21001
  MEM2051-00-195-00-A
- AXIOM Beta Power Board
- Level Translation and uSD
- Copyright (C) 2014-2017 H.Poetzl
  Licensed under CERN OHL v.1.2

## Sheet 6 of 14
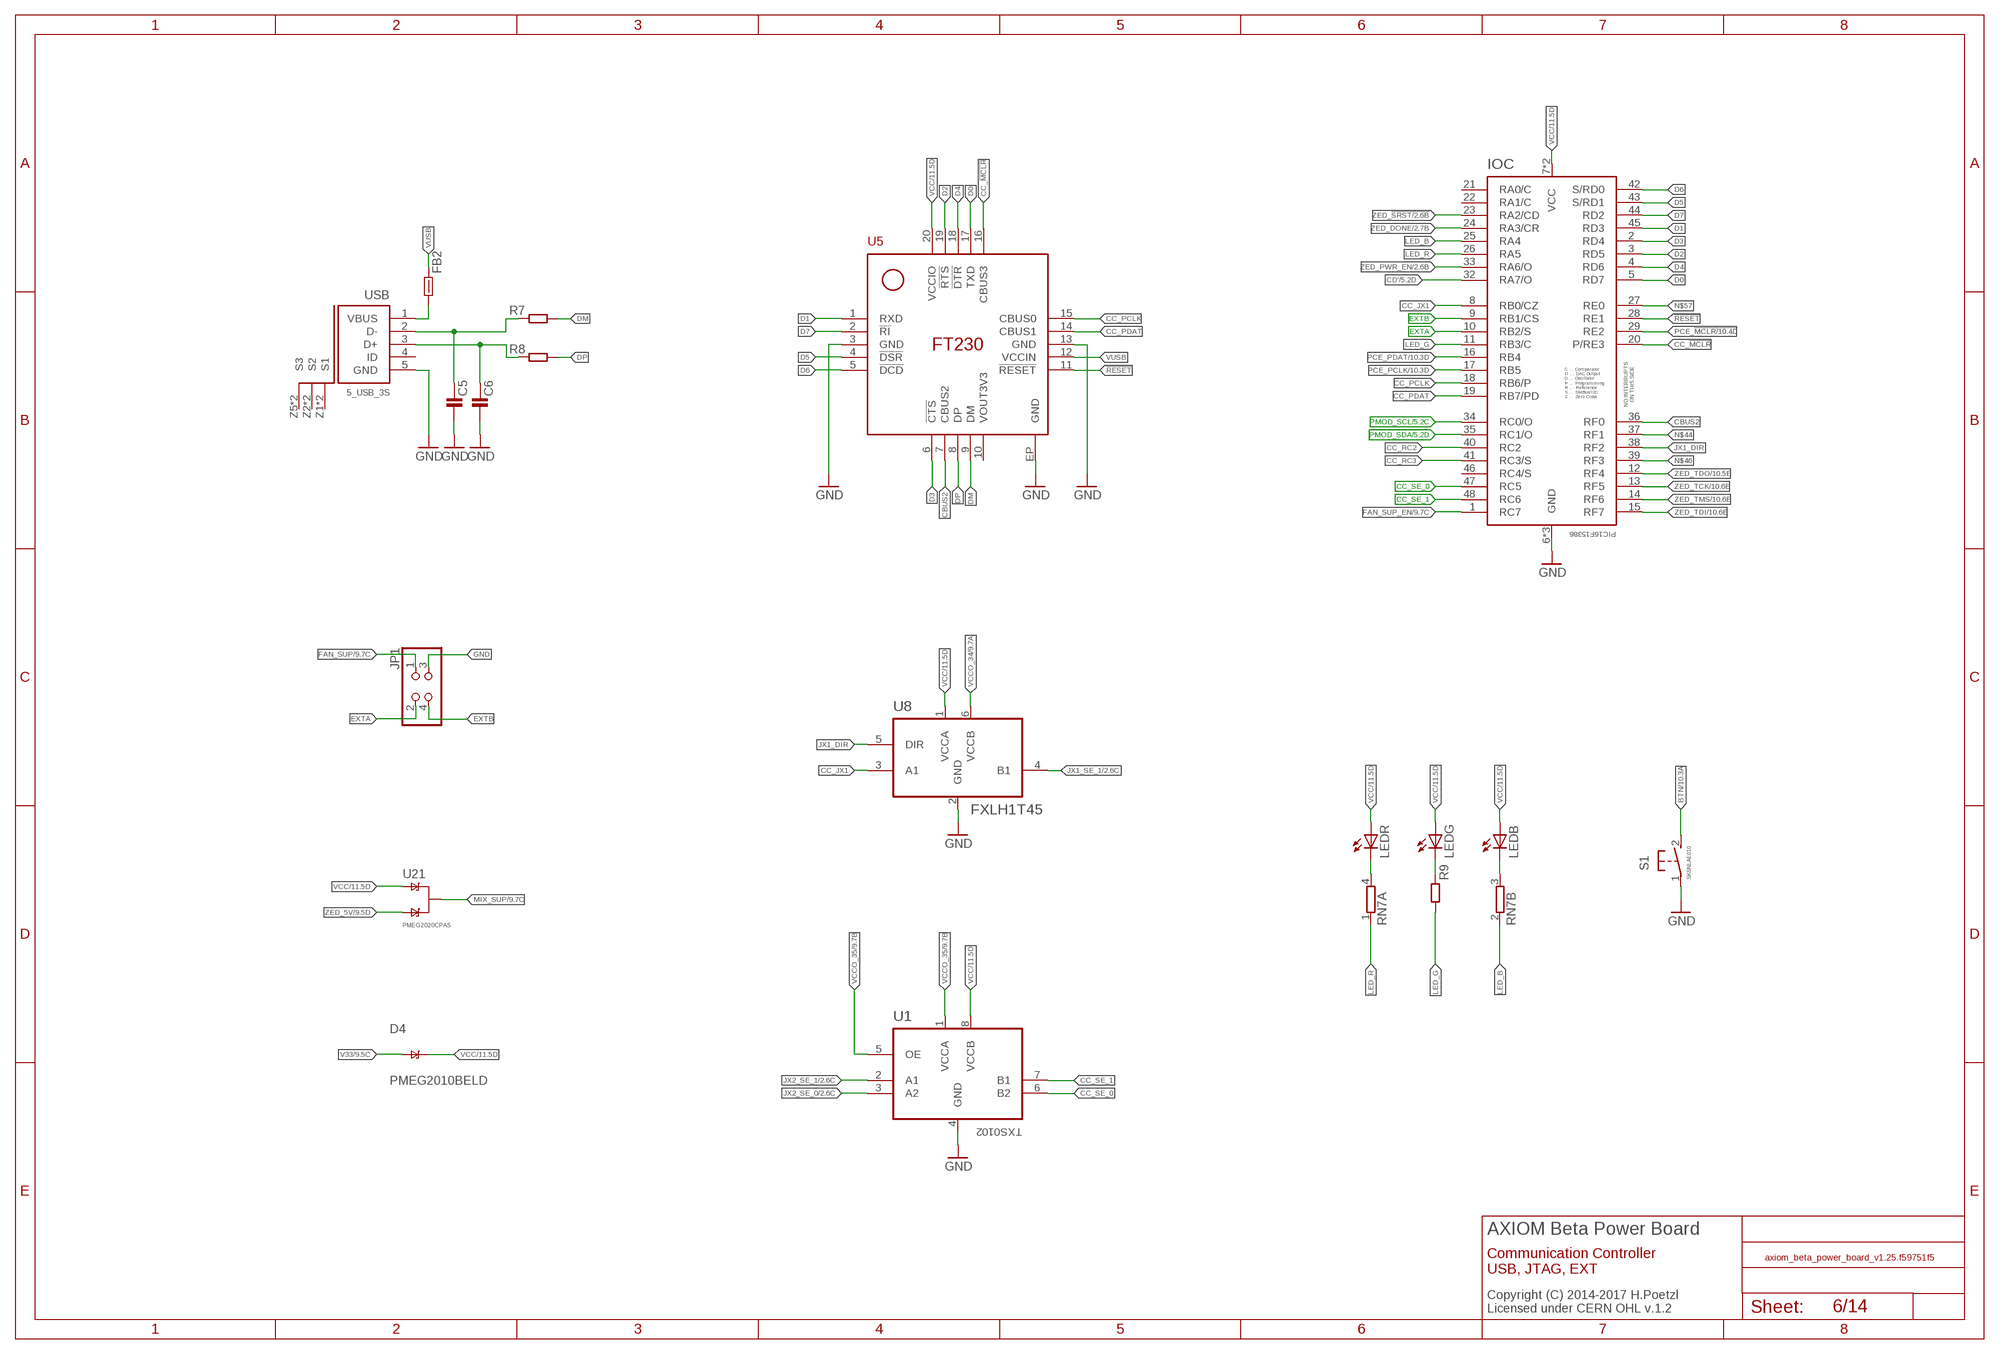
[diagram p5: schematic, sheet 6]

### Parts
C5  C0402-C  [0402-C]
C6  C0402-C  [0402-C]
D4  PMEG2010BELD  [DFN1006D-2]
FB2  FB0402-C  [0402-C]
IOC  PIC16F15386  PIC16F15386-NSM  [UQFN40P600X600X100-49N-NSM]
JP1  PINHD-2X02  [2X02M/90-S]  (not fitted in variant Beta)
LED  MSL0104RGB  RGB-LED  [MSL0104]
R7  R0402-C  [0402-C]
R8  R0402-C  [0402-C]
R9  R0402-C  [0402-C]
RN7  2R-NEXB14V  [EXB14V]
S1  SKSNLAE010  [SKSNLAE010]
U1  TXS0102  [X2SON-8]
U5  FT231  [QFN65P400X400X100-21N]
U8  FXLH1T45  [MICROPAK-6]
U21  PMEG2020CPAS  [DFN2020D-3]
USB  5_USB_3S  [MICRO-AB-H-SMT]

### Nets
!RESET: IOC.28(RE1) U5.11(!RESET)
BTN: S1.2 ; also sheet 10
CBUS2: IOC.36(RF0) U5.7(CBUS2)
CC_!MCLR: IOC.20(P/RE3) U5.16(CBUS3)
CC_JX1: IOC.8(RB0/CZ) U8.3(A1)
CC_PCLK: IOC.18(RB6/P) U5.15(CBUS0)
CC_PDAT: IOC.19(RB7/PD) U5.14(CBUS1)
CC_RC2: IOC.40(RC2)
CC_RC3: IOC.41(RC3/S)
CC_SE_0: IOC.47(RC5) U1.6(B2)
CC_SE_1: IOC.48(RC6) U1.7(B1)
CD': IOC.32(RA7/O) ; also sheet 5
D0: IOC.5(RD7) U5.17(TXD)
D1: IOC.45(RD3) U5.1(RXD)
D2: IOC.3(RD5) U5.19(!RTS)
D3: IOC.2(RD4) U5.6(!CTS)
D4: IOC.4(RD6) U5.18(!DTR)
D5: IOC.43(S/RD1) U5.4(!DSR)
D6: IOC.42(S/RD0) U5.5(!DCD)
D7: IOC.44(RD2) U5.2(!RI)
DM: R7.2 U5.9(DM)
DP: R8.2 U5.8(DP)
EXTA: IOC.10(RB2/S) JP1.2
EXTB: IOC.9(RB1/CS) JP1.4
FAN_SUP: JP1.1 ; also sheet 9
FAN_SUP_EN: IOC.1(RC7) ; also sheet 9
GND: C5.2 C6.2 IOC.6(GND) IOC.31(GND) IOC.EP(GND) JP1.3 S1.1 U1.4(GND) U5.3(GND) U5.13(GND) U5.EP(GND) U8.2(GND) USB.5(GND) ; also sheet 2,3,5,7,8,9,10,11,12,13,14
JX1_DIR: IOC.38(RF2) U8.5(DIR)
JX1_SE_1: U8.4(B1) ; also sheet 2,3
JX2_SE_0: U1.3(A2) ; also sheet 2
JX2_SE_1: U1.2(A1) ; also sheet 2
LED_B: IOC.25(RA4) RN7.2
LED_G: IOC.11(RB3/C) R9.2
LED_R: IOC.26(RA5) RN7.1
MIX_SUP: U21.3(K) U21.4(K) ; also sheet 9
N$4: LED.5(B:C) RN7.3
N$7: LED.4(R:C) RN7.4
N$8: LED.3(G:C) R9.1
N$12: C5.1 R7.1 USB.2(D-)
N$17: C6.1 R8.1 USB.3(D+)
N$44: IOC.37(RF1)
N$46: IOC.39(RF3)
N$57: IOC.27(RE0)
PCE_!MCLR: IOC.29(RE2) ; also sheet 10
PCE_PCLK: IOC.17(RB5) ; also sheet 10
PCE_PDAT: IOC.16(RB4) ; also sheet 10
PMOD_SCL: IOC.34(RC0/O) ; also sheet 5
PMOD_SDA: IOC.35(RC1/O) ; also sheet 5
V33: D4.A ; also sheet 9
VBUS: FB2.2 USB.1(VBUS)
VCC: D4.C(K) IOC.7(VCC) IOC.30(VCC) LED.1(R:A) LED.2(G:A) LED.6(B:A) LED.7(R:A) U1.8(VCCB) U5.20(VCCIO) U8.1(VCCA) U21.1(A1) ; also sheet 5,11
VCCO_34: U8.6(VCCB) ; also sheet 2,9,12
VCCO_35: U1.1(VCCA) U1.5(OE) ; also sheet 2,9,12
VUSB: FB2.1 U5.12(VCCIN)
ZED_5V: U21.2(A2) ; also sheet 2,9
ZED_!SRST: IOC.23(RA2/CD) ; also sheet 2
ZED_DONE: IOC.24(RA3/CR) ; also sheet 2
ZED_PWR_EN: IOC.33(RA6/O) ; also sheet 2
ZED_TCK: IOC.13(RF5) ; also sheet 10
ZED_TDI: IOC.15(RF7) ; also sheet 10
ZED_TDO: IOC.12(RF4) ; also sheet 10
ZED_TMS: IOC.14(RF6) ; also sheet 10
Unconnected: IOC.21(RA0/C) IOC.22(RA1/C) IOC.46(RC4/S) USB.4(ID) USB.Z1(S1) USB.Z2(S2) USB.Z3(S2) USB.Z4(S1) USB.Z5(S3) USB.Z6(S3)

### Notes on the sheet
- AXIOM Beta Power Board
- Communication Controller
  USB, JTAG, EXT
- Copyright (C) 2014-2017 H.Poetzl
  Licensed under CERN OHL v.1.2

## Sheet 7 of 14
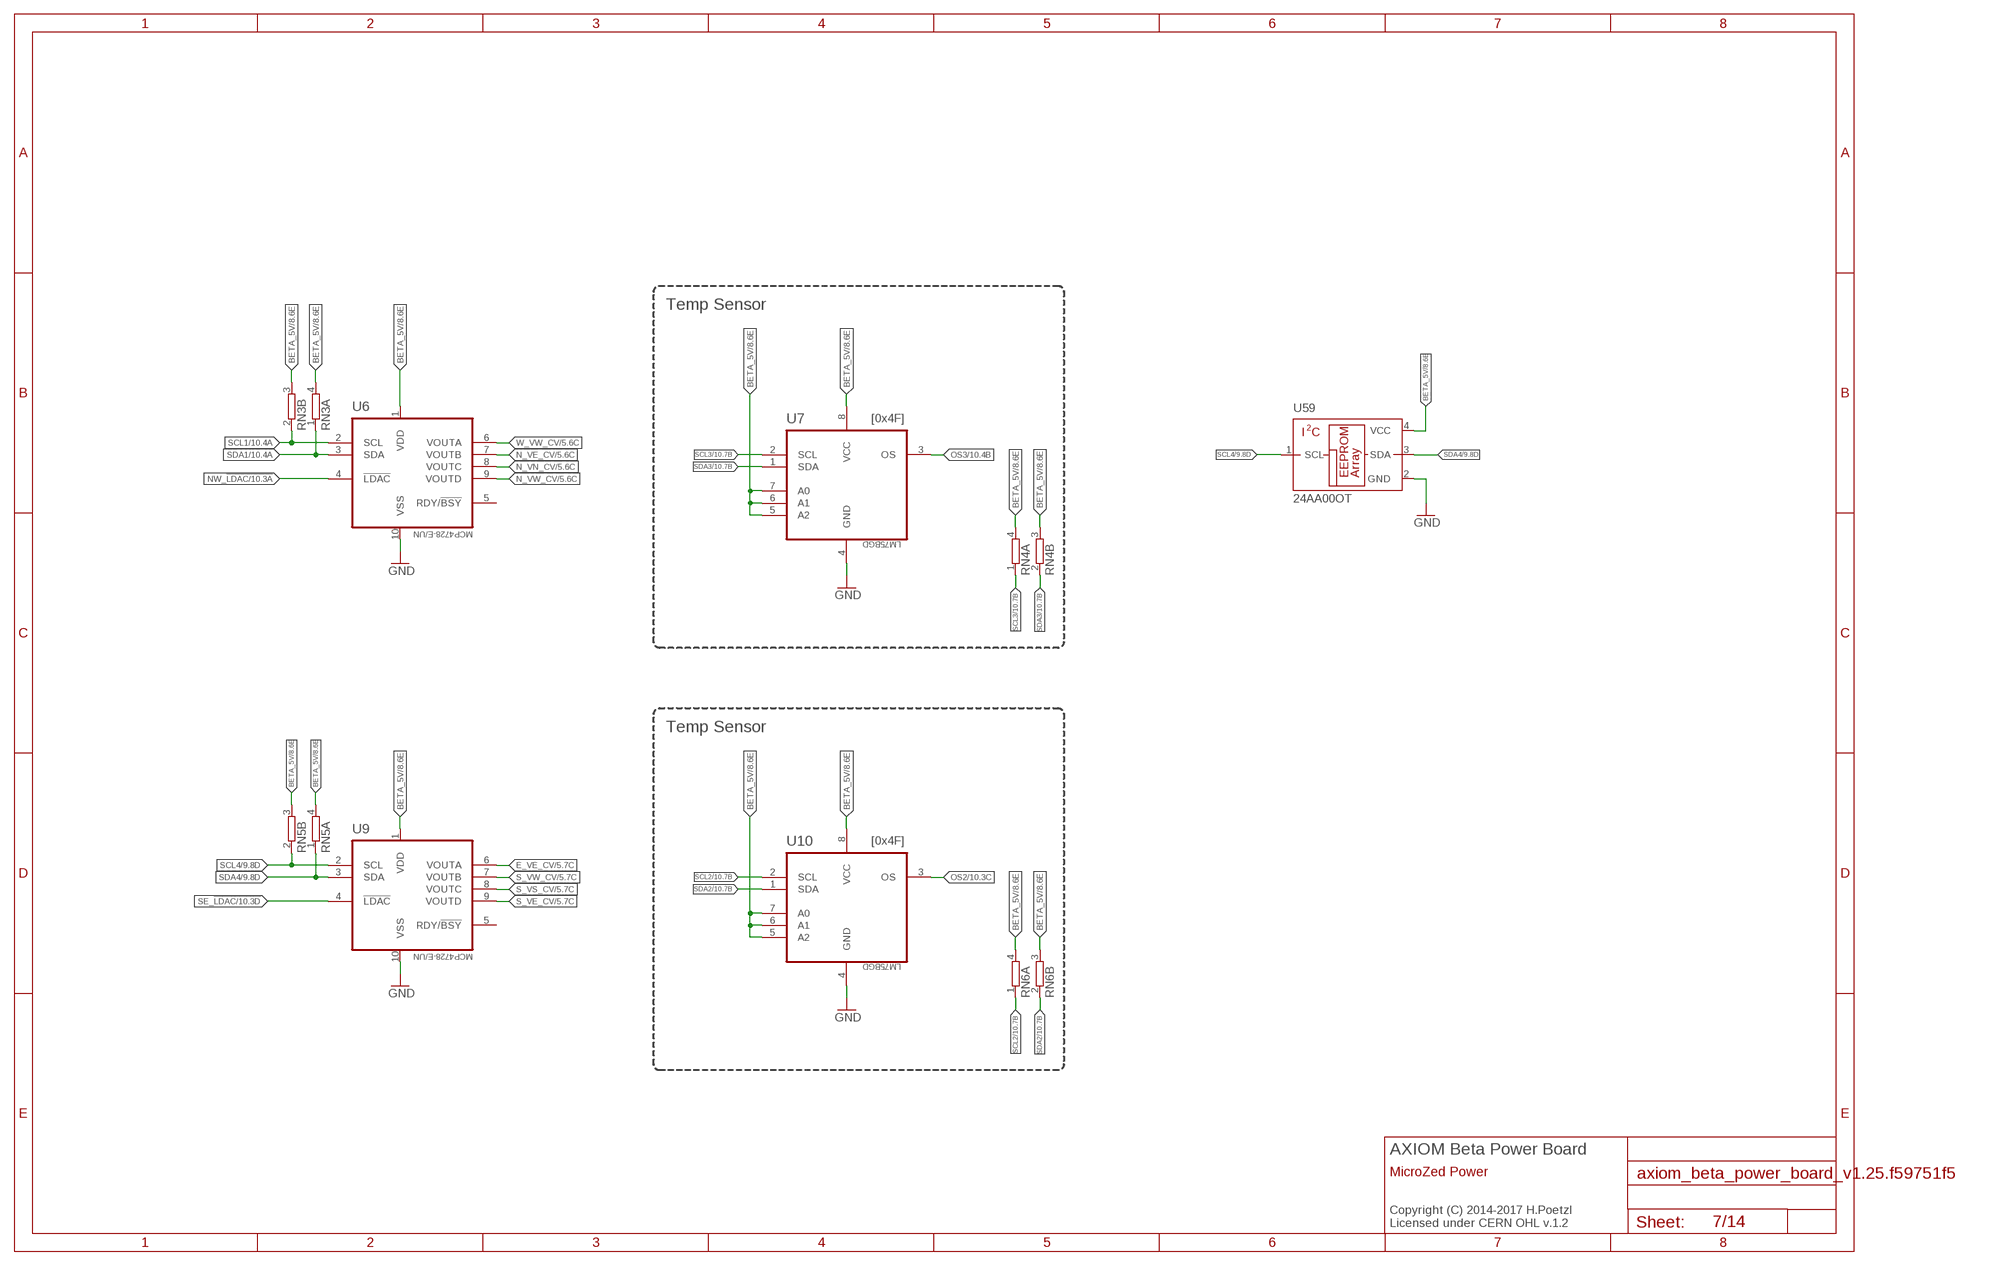
[diagram p6: schematic, sheet 7]

### Parts
RN3  2R-NEXB24V  [EXB24V]
RN4  2R-NEXB24V  [EXB24V]
RN5  2R-NEXB24V  [EXB24V]
RN6  2R-NEXB24V  [EXB24V]
U6  MCP4728-E/UN  [SOP50P490X110-10N]
U7  LM75BGD  [SOT996-2/3]
U9  MCP4728-E/UN  [SOP50P490X110-10N]
U10  LM75BGD  [SOT996-2/3]
U59  24AA00OT  [SOT23-5L]

### Nets
BETA_5V: RN3.3 RN3.4 RN4.3 RN4.4 RN5.3 RN5.4 RN6.3 RN6.4 U6.1(VDD) U7.5(A2) U7.6(A1) U7.7(A0) U7.8(VCC) U9.1(VDD) U10.5(A2) U10.6(A1) U10.7(A0) U10.8(VCC) U59.4(VCC) ; also sheet 8,9,10,12,13,14
E_VE_CV: U9.6(VOUTA) ; also sheet 5
GND: U6.10(VSS) U7.4(GND) U9.10(VSS) U10.4(GND) U59.2(GND) ; also sheet 2,3,5,6,8,9,10,11,12,13,14
N_VE_CV: U6.7(VOUTB) ; also sheet 5
N_VN_CV: U6.8(VOUTC) ; also sheet 5
N_VW_CV: U6.9(VOUTD) ; also sheet 5
NW_!LDAC: U6.4(!LDAC) ; also sheet 10
OS2: U10.3(OS) ; also sheet 10
OS3: U7.3(OS) ; also sheet 10
S_VE_CV: U9.9(VOUTD) ; also sheet 5
S_VS_CV: U9.8(VOUTC) ; also sheet 5
S_VW_CV: U9.7(VOUTB) ; also sheet 5
SCL1: RN3.2 U6.2(SCL) ; also sheet 10,12
SCL2: RN6.1 U10.2(SCL) ; also sheet 10,13
SCL3: RN4.1 U7.2(SCL) ; also sheet 10,14
SCL4: RN5.2 U9.2(SCL) U59.1(SCL) ; also sheet 9,10
SDA1: RN3.1 U6.3(SDA) ; also sheet 10,12
SDA2: RN6.2 U10.1(SDA) ; also sheet 10,13
SDA3: RN4.2 U7.1(SDA) ; also sheet 10,14
SDA4: RN5.1 U9.3(SDA) U59.3(SDA) ; also sheet 9,10
SE_!LDAC: U9.4(!LDAC) ; also sheet 10
W_VW_CV: U6.6(VOUTA) ; also sheet 5
Unconnected: U6.5(RDY/!BSY) U9.5(RDY/!BSY)

### Notes on the sheet
- Temp Sensor
- [0x4F]
- Temp Sensor
- [0x4F]
- AXIOM Beta Power Board
- MicroZed Power
- Copyright (C) 2014-2017 H.Poetzl
  Licensed under CERN OHL v.1.2

## Sheet 8 of 14
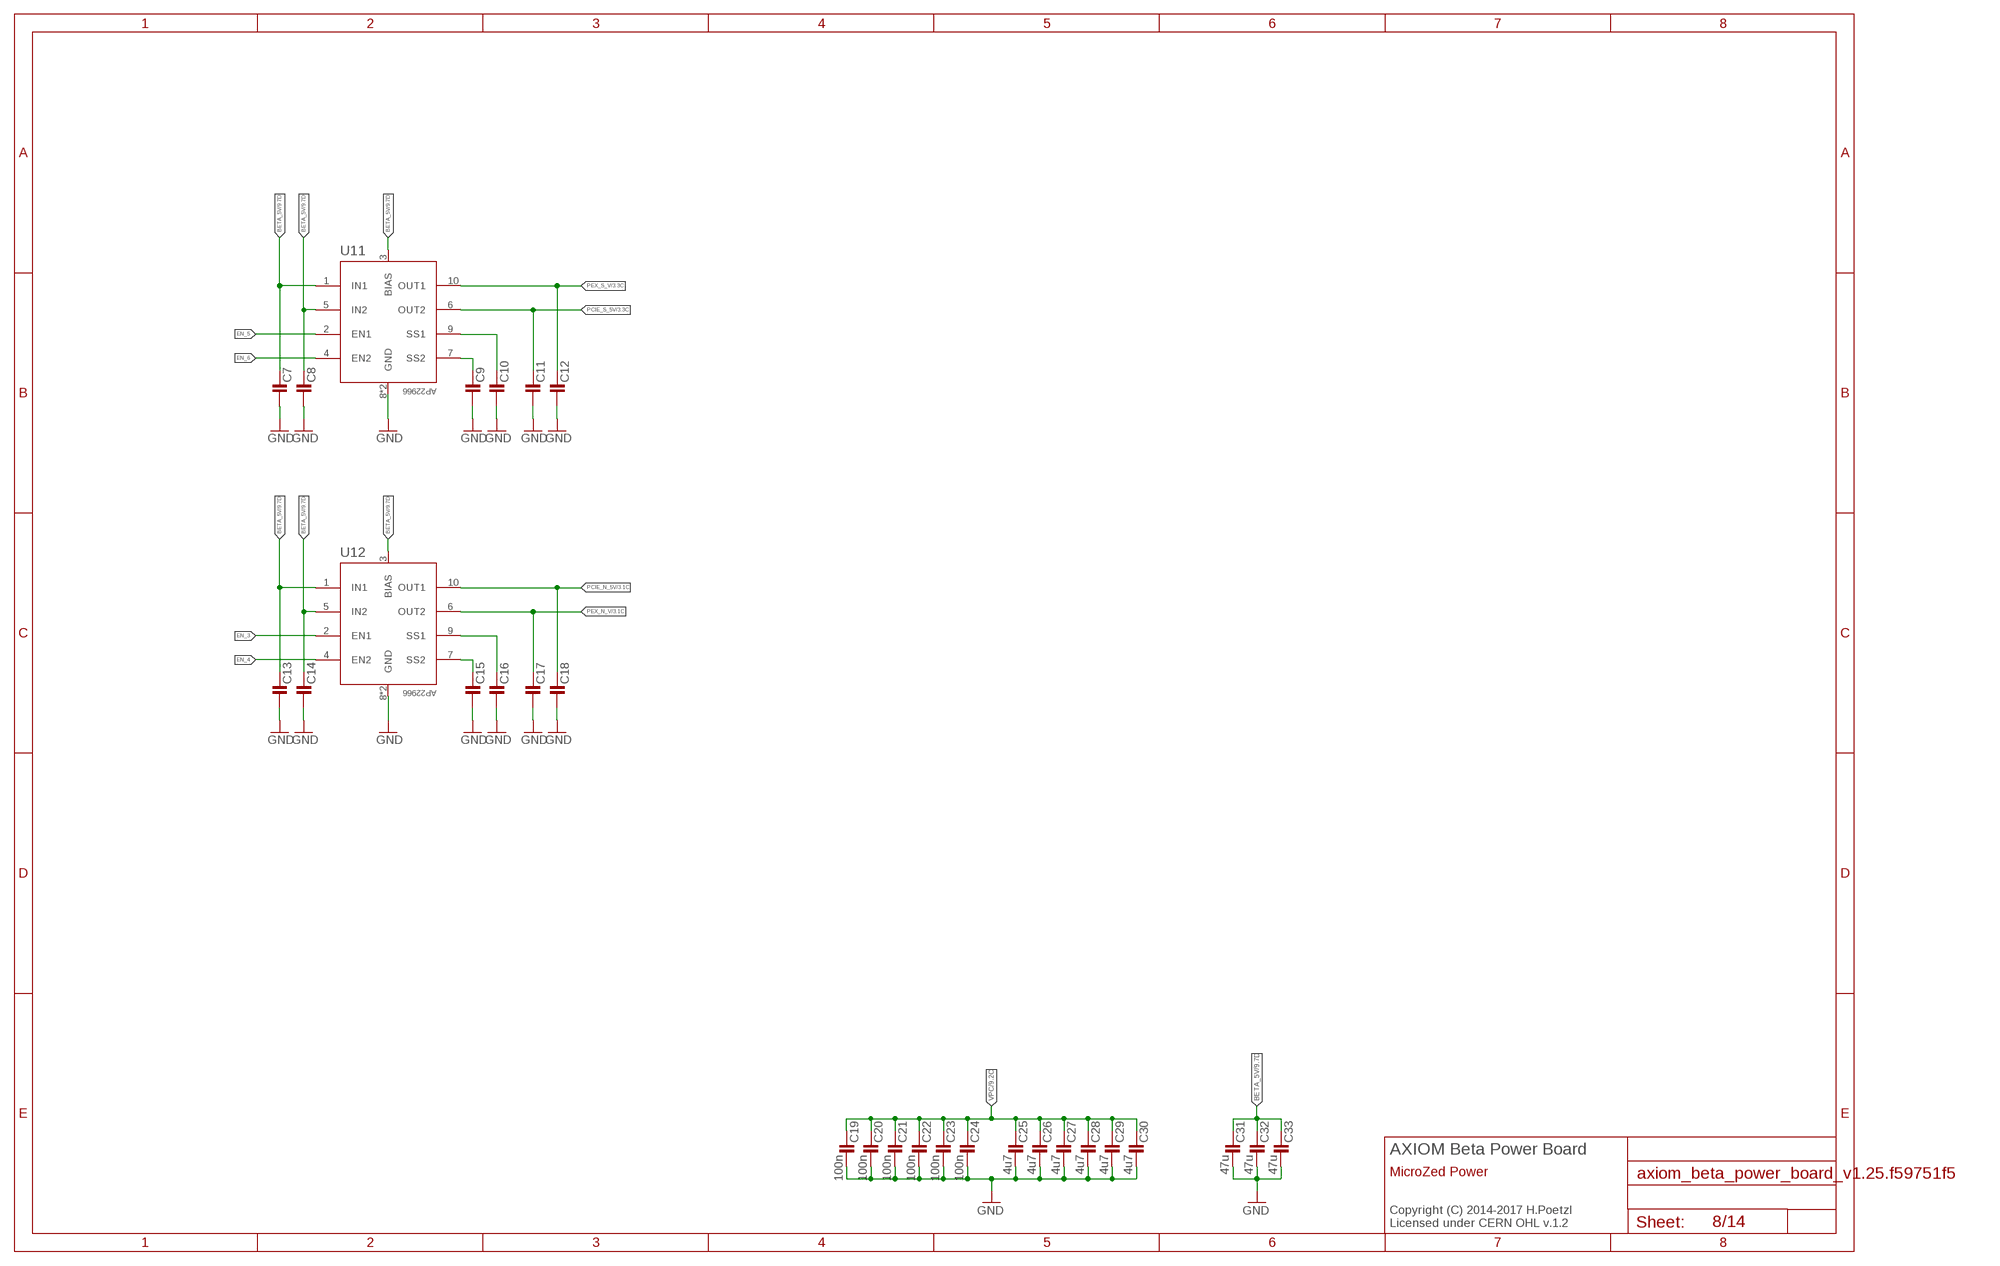
[diagram p7: schematic, sheet 8]

### Parts
C7  C0402-C  [0402-C]
C8  C0402-C  [0402-C]
C9  C0201-C  [0201-C]
C10  C0201-C  [0201-C]
C11  C0402-C  [0402-C]
C12  C0402-C  [0402-C]
C13  C0402-C  [0402-C]
C14  C0402-C  [0402-C]
C15  C0201-C  [0201-C]
C16  C0201-C  [0201-C]
C17  C0402-C  [0402-C]
C18  C0402-C  [0402-C]
C19  100n  C0402-C  [0402-C]
C20  100n  C0402-C  [0402-C]
C21  100n  C0402-C  [0402-C]
C22  100n  C0402-C  [0402-C]
C23  100n  C0402-C  [0402-C]
C24  100n  C0402-C  [0402-C]
C25  4u7  C0402-C  [0402-C]
C26  4u7  C0402-C  [0402-C]
C27  4u7  C0402-C  [0402-C]
C28  4u7  C0402-C  [0402-C]
C29  4u7  C0402-C  [0402-C]
C30  4u7  C0402-C  [0402-C]
C31  47u  C0805-C  [0805-C]
C32  47u  C0805-C  [0805-C]
C33  47u  C0805-C  [0805-C]
U11  AP22966  [V-DFN3020-14]
U12  AP22966  [V-DFN3020-14]

### Nets
BETA_5V: C7.1 C8.1 C13.1 C14.1 C31.1 C32.1 C33.1 U11.1(IN1) U11.3(BIAS) U11.5(IN2) U12.1(IN1) U12.3(BIAS) U12.5(IN2) ; also sheet 7,9,10,12,13,14
EN_3: U12.2(EN1)
EN_4: U12.4(EN2)
EN_5: U11.2(EN1)
EN_6: U11.4(EN2)
GND: C7.2 C8.2 C9.2 C10.2 C11.2 C12.2 C13.2 C14.2 C15.2 C16.2 C17.2 C18.2 C19.2 C20.2 C21.2 C22.2 C23.2 C24.2 C25.2 C26.2 C27.2 C28.2 C29.2 C30.2 C31.2 C32.2 C33.2 U11.8(GND) U11.EP(GND) U12.8(GND) U12.EP(GND) ; also sheet 2,3,5,6,7,9,10,11,12,13,14
N$23: C15.1 U12.7(SS2)
N$24: C16.1 U12.9(SS1)
N$25: C9.1 U11.7(SS2)
N$26: C10.1 U11.9(SS1)
PCIE_N_5V: C18.1 U12.10(OUT1) ; also sheet 3
PCIE_S_5V: C11.1 U11.6(OUT2) ; also sheet 3
PEX_N_V: C17.1 U12.6(OUT2) ; also sheet 3
PEX_S_V: C12.1 U11.10(OUT1) ; also sheet 3
VPC: C19.1 C20.1 C21.1 C22.1 C23.1 C24.1 C25.1 C26.1 C27.1 C28.1 C29.1 C30.1 ; also sheet 5,9,10

### Notes on the sheet
- AXIOM Beta Power Board
- MicroZed Power
- Copyright (C) 2014-2017 H.Poetzl
  Licensed under CERN OHL v.1.2

## Sheet 9 of 14
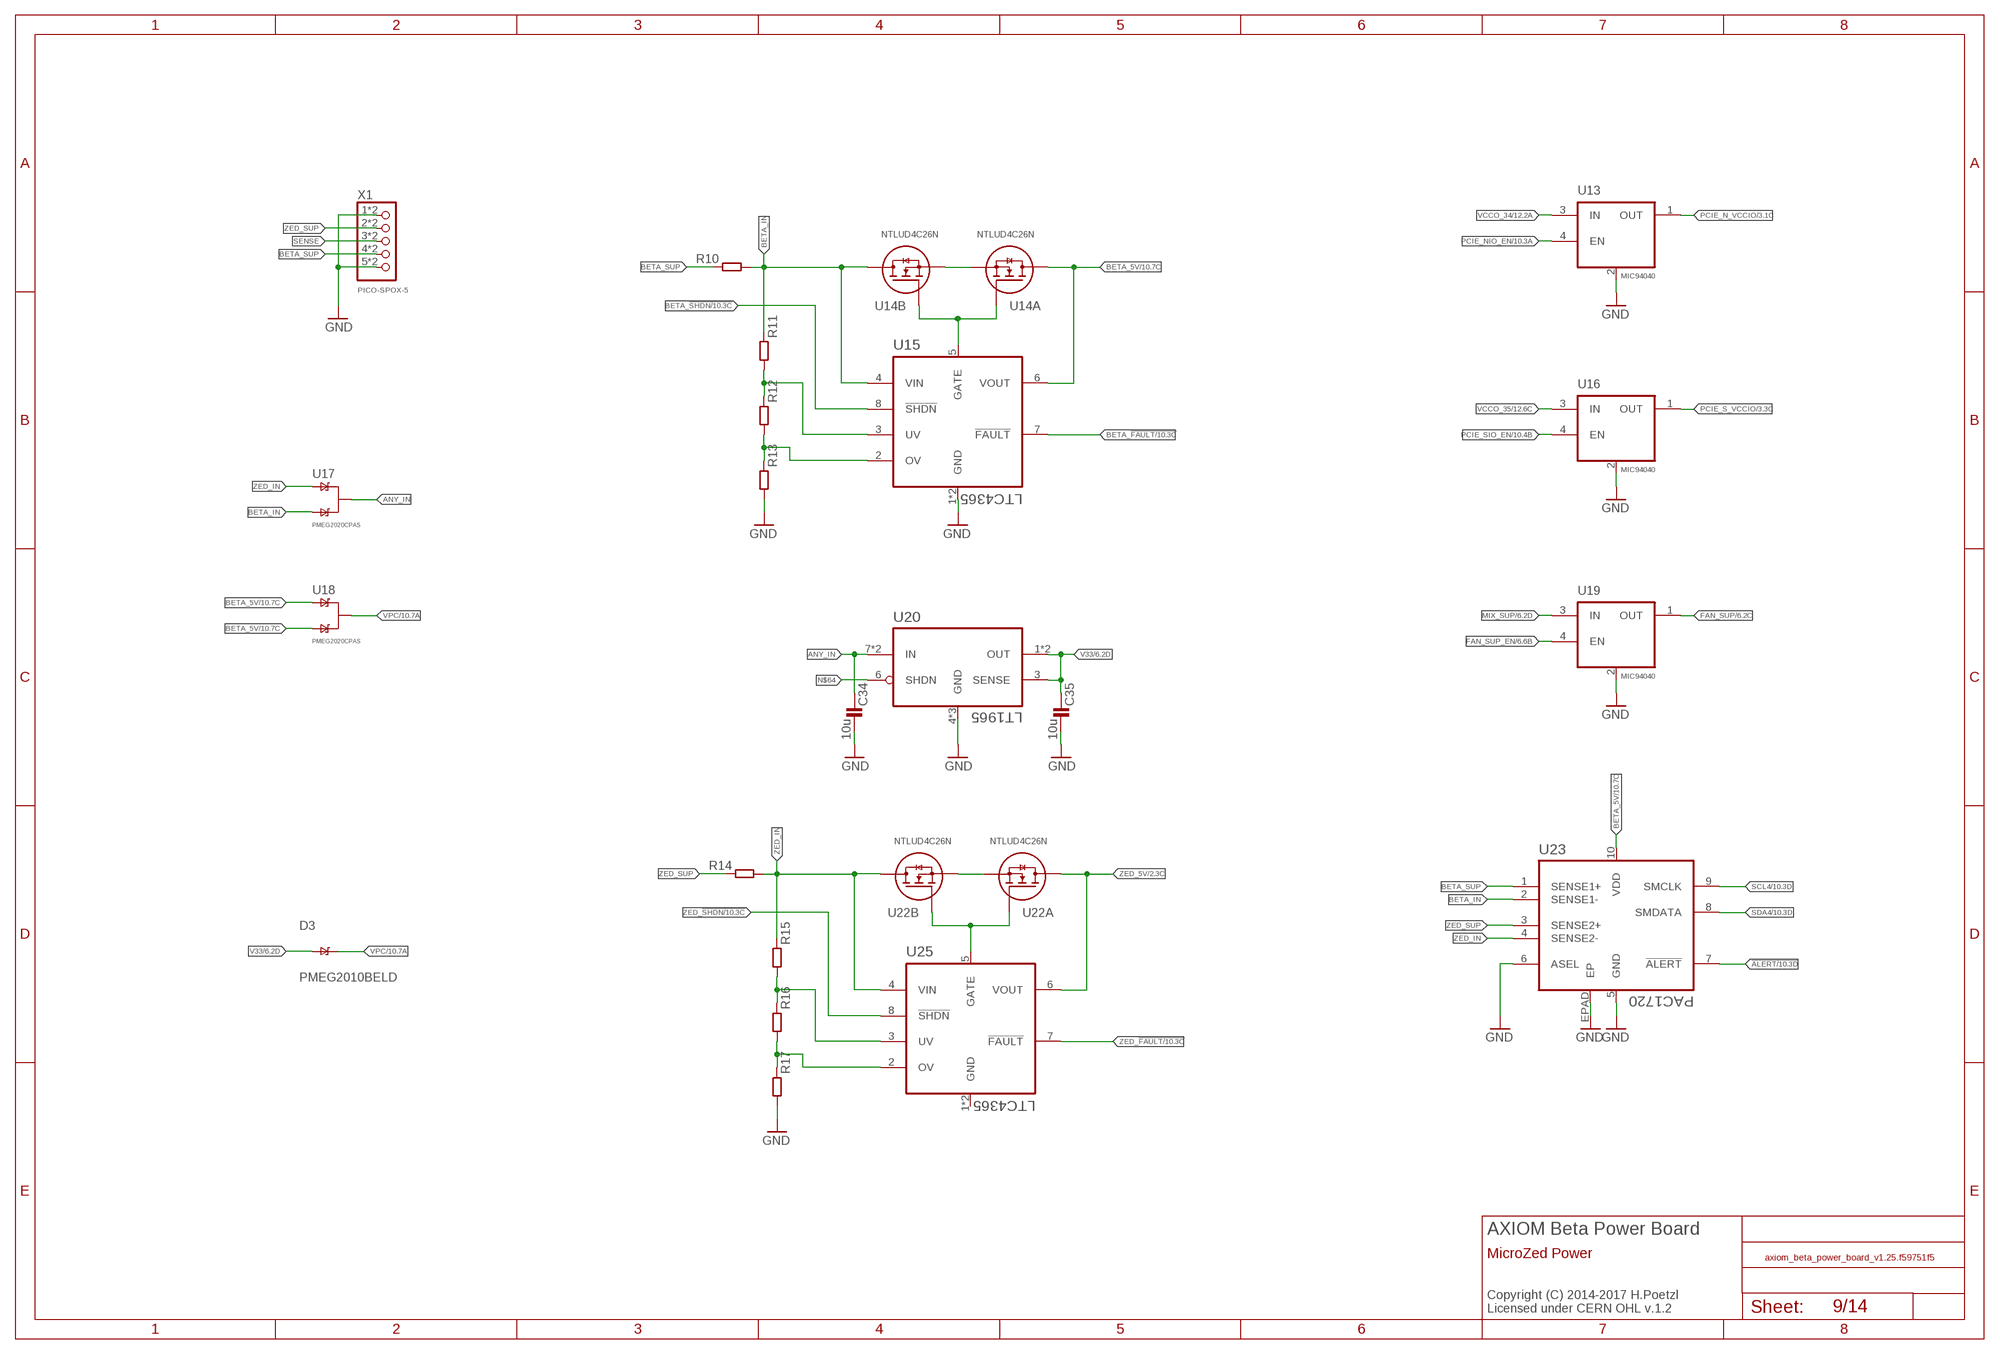
[diagram p8: schematic, sheet 9]

### Parts
C34  10u  C0603-C  [0603-C]
C35  10u  C0603-C  [0603-C]
D3  PMEG2010BELD  [DFN1006D-2]
R10  R0805-C  [0805-C]
R11  R0402-C  [0402-C]
R12  R0402-C  [0402-C]
R13  R0402-C  [0402-C]
R14  R0805-C  [0805-C]
R15  R0402-C  [0402-C]
R16  R0402-C  [0402-C]
R17  R0402-C  [0402-C]
U13  MIC94040  [MLF-4]
U14  NTLUD4C26N  [UDFN6]
U15  LTC4365  [DFN8]
U16  MIC94040  [MLF-4]
U17  PMEG2020CPAS  [DFN2020D-3]
U18  PMEG2020CPAS  [DFN2020D-3]
U19  MIC94040  [MLF-4]
U20  LT1965  [DFN3X3_8LEAD]
U22  NTLUD4C26N  [UDFN6]
U23  PAC1720  [DFN3X3_10LEAD]
U25  LTC4365  [DFN8]
X1  PICO-SPOX-5  [PICO-SPOX-5]

### Nets
!ALERT: U23.7(!ALERT) ; also sheet 10
ANY_IN: C34.1 U17.3(K) U17.4(K) U20.7(IN) U20.8(IN)
BETA_5V: U14.6(A:D) U14.D1(A:D) U15.6(VOUT) U18.1(A1) U18.2(A2) U23.10(VDD) ; also sheet 7,8,10,12,13,14
BETA_!FAULT: U15.7(!FAULT) ; also sheet 10
BETA_!SHDN: U15.8(!SHDN) ; also sheet 10
BETA_GATE: U14.2(A:G) U14.5(B:G) U15.5(GATE)
BETA_IN: R10.2 R11.1 U14.3(B:D) U14.D2(B:D) U15.4(VIN) U17.2(A2) U23.2(SENSE1-)
BETA_OV: R12.2 R13.1 U15.2(OV)
BETA_SUP: R10.1 U23.1(SENSE1+) X1.4 X1.4A
BETA_UV: R11.2 R12.1 U15.3(UV)
FAN_SUP: U19.1(OUT) ; also sheet 6
FAN_SUP_EN: U19.4(EN) ; also sheet 6
GND: C34.2 C35.2 R13.2 R17.2 U13.2(GND) U15.1(GND) U15.EP(GND) U16.2(GND) U19.2(GND) U20.4(GND) U20.5(GND) U20.9(GND) U23.5(GND) U23.6(ASEL) U23.EPAD(EP) X1.1 X1.1A X1.5 X1.5A ; also sheet 2,3,5,6,7,8,10,11,12,13,14
MIX_SUP: U19.3(IN) ; also sheet 6
N$18: U14.1(A:S) U14.4(B:S)
N$38: U22.1(A:S) U22.4(B:S)
N$64: U20.6(SHDN)
PCIE_N_VCCIO: U13.1(OUT) ; also sheet 3
PCIE_NIO_EN: U13.4(EN) ; also sheet 10
PCIE_S_VCCIO: U16.1(OUT) ; also sheet 3
PCIE_SIO_EN: U16.4(EN) ; also sheet 10
SCL4: U23.9(SMCLK) ; also sheet 7,10
SDA4: U23.8(SMDATA) ; also sheet 7,10
SENSE: X1.3 X1.3A
V33: C35.1 D3.A U20.1(OUT) U20.2(OUT) U20.3(SENSE) ; also sheet 6
VCCO_34: U13.3(IN) ; also sheet 2,6,12
VCCO_35: U16.3(IN) ; also sheet 2,6,12
VPC: D3.C(K) U18.3(K) U18.4(K) ; also sheet 5,8,10
ZED_5V: U22.6(A:D) U22.D1(A:D) U25.6(VOUT) ; also sheet 2,6
ZED_!FAULT: U25.7(!FAULT) ; also sheet 10
ZED_!SHDN: U25.8(!SHDN) ; also sheet 10
ZED_GATE: U22.2(A:G) U22.5(B:G) U25.5(GATE)
ZED_IN: R14.2 R15.1 U17.1(A1) U22.3(B:D) U22.D2(B:D) U23.4(SENSE2-) U25.4(VIN)
ZED_OV: R16.2 R17.1 U25.2(OV)
ZED_SUP: R14.1 U23.3(SENSE2+) X1.2 X1.2A
ZED_UV: R15.2 R16.1 U25.3(UV)

### Notes on the sheet
- AXIOM Beta Power Board
- MicroZed Power
- Copyright (C) 2014-2017 H.Poetzl
  Licensed under CERN OHL v.1.2

## Sheet 10 of 14
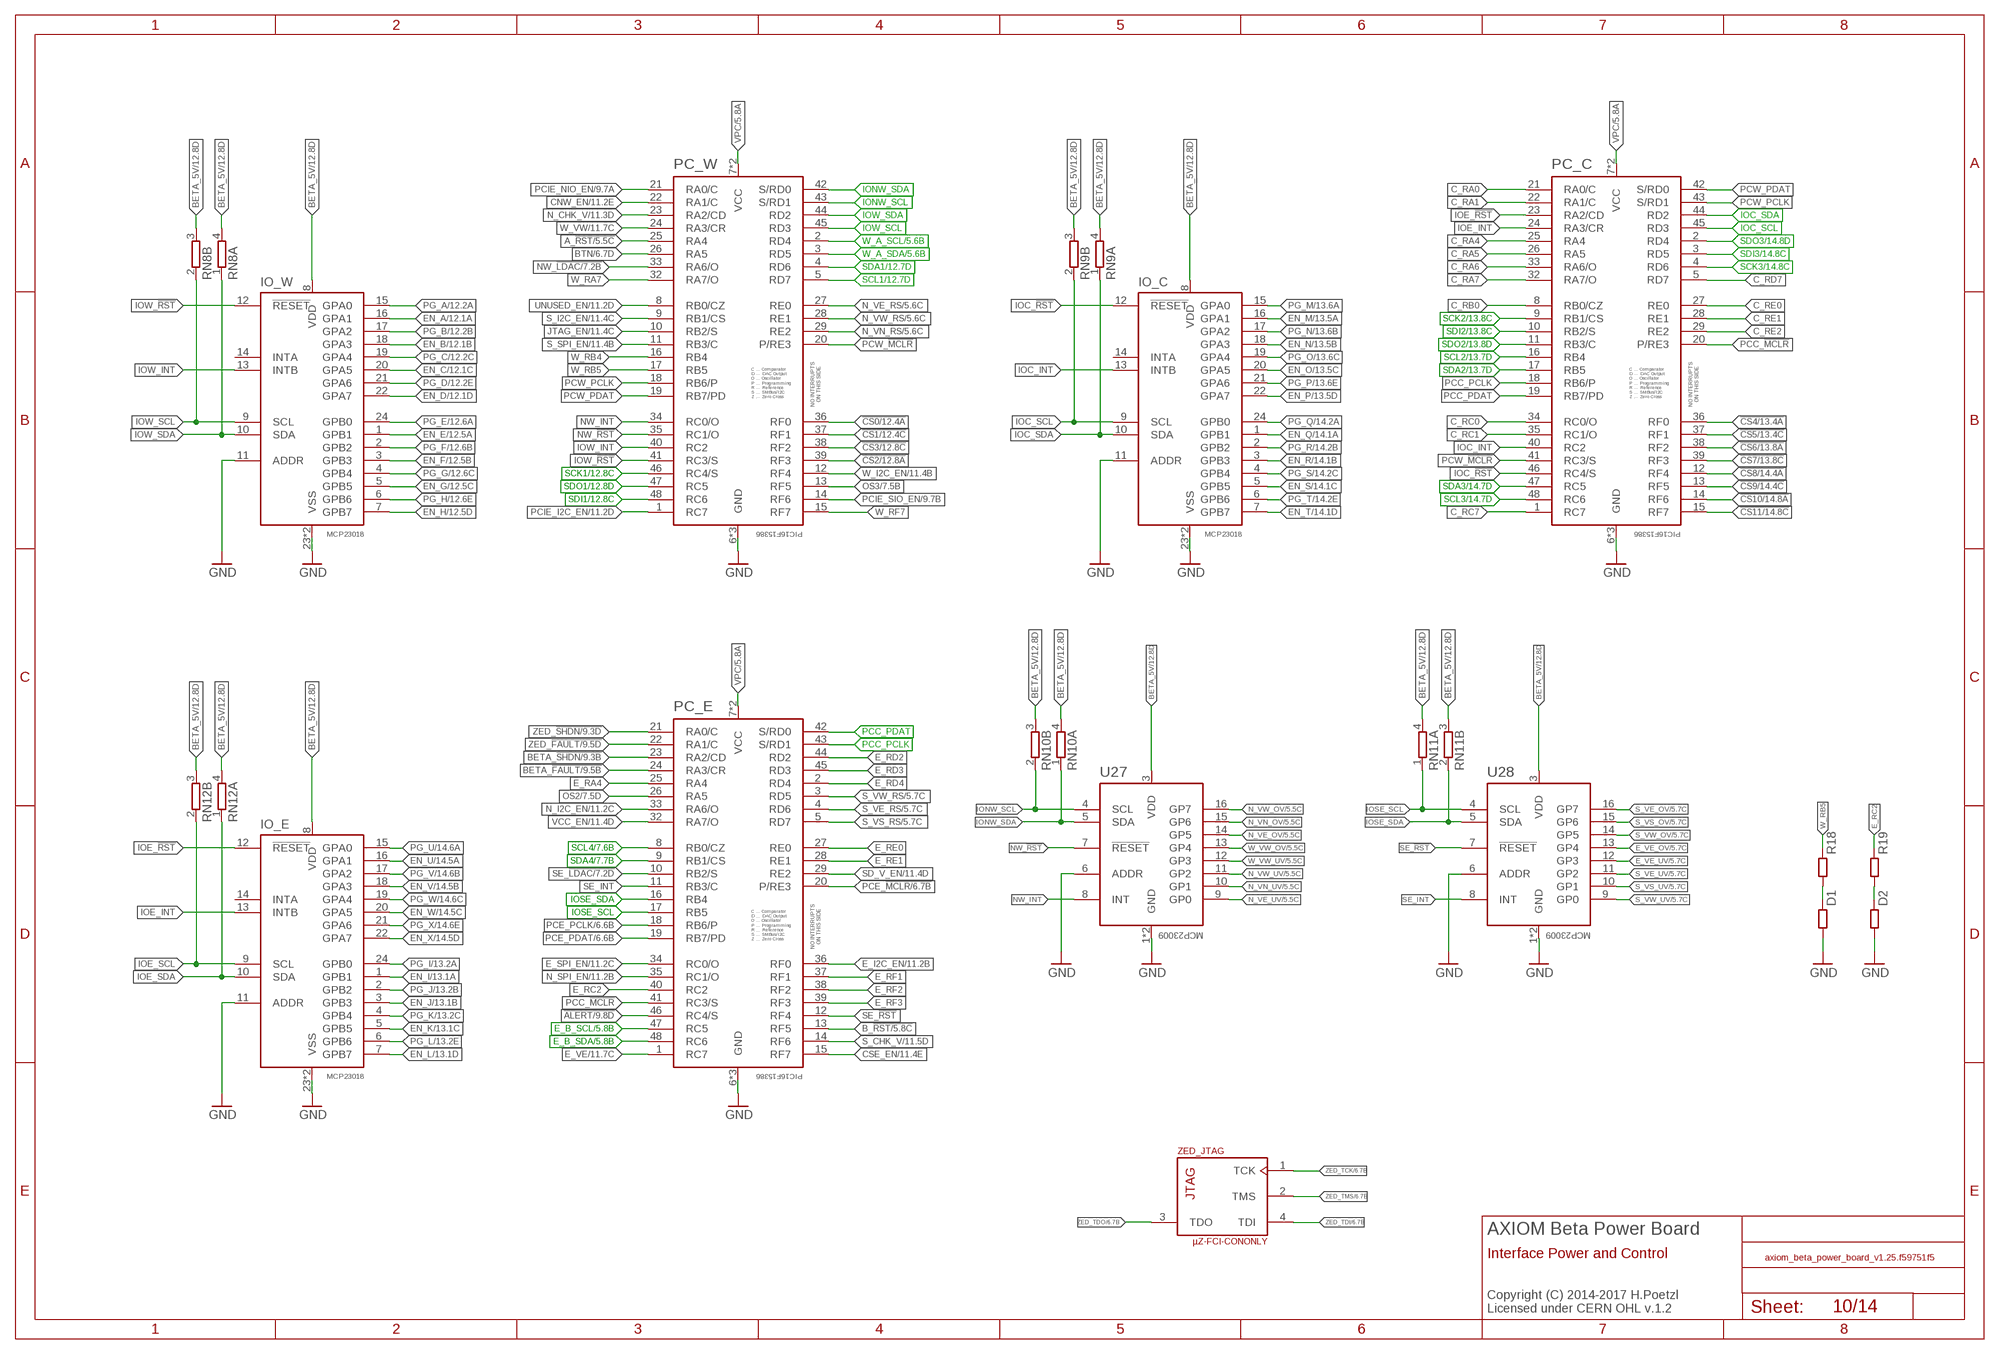
[diagram p9: schematic, sheet 10]

### Parts
D1  R0402-C  [0402-C]
D2  R0402-C  [0402-C]
IO_C  MCP23018  MCP23018-NSM  [QFN50P400X400X80-25N-NSM]
IO_E  MCP23018  MCP23018-NSM  [QFN50P400X400X80-25N-NSM]
IO_W  MCP23018  MCP23018-NSM  [QFN50P400X400X80-25N-NSM]
PC_C  PIC16F15386  PIC16F15386-NSM  [UQFN40P600X600X100-49N-NSM]
PC_E  PIC16F15386  PIC16F15386-NSM  [UQFN40P600X600X100-49N-NSM]
PC_W  PIC16F15386  PIC16F15386-NSM  [UQFN40P600X600X100-49N-NSM]
R18  R0402-C  [0402-C]
R19  R0402-C  [0402-C]
RN8  2R-NEXB24V  [EXB24V]
RN9  2R-NEXB24V  [EXB24V]
RN10  2R-NEXB24V  [EXB24V]
RN11  2R-NEXB24V  [EXB24V]
RN12  2R-NEXB24V  [EXB24V]
U27  MCP23009  MCP23009-E/MG  [QFN50P300X300X80-17N]
U28  MCP23009  MCP23009-E/MG  [QFN50P300X300X80-17N]

### Nets
!ALERT: PC_E.46(RC4/S) ; also sheet 9
!CS0: PC_W.36(RF0) ; also sheet 12
!CS1: PC_W.37(RF1) ; also sheet 12
!CS2: PC_W.39(RF3) ; also sheet 12
!CS3: PC_W.38(RF2) ; also sheet 12
!CS4: PC_C.36(RF0) ; also sheet 13
!CS5: PC_C.37(RF1) ; also sheet 13
!CS6: PC_C.38(RF2) ; also sheet 13
!CS7: PC_C.39(RF3) ; also sheet 13
!CS8: PC_C.12(RF4) ; also sheet 14
!CS9: PC_C.13(RF5) ; also sheet 14
!CS10: PC_C.14(RF6) ; also sheet 14
!CS11: PC_C.15(RF7) ; also sheet 14
A_!RST: PC_W.25(RA4) ; also sheet 5
B_!RST: PC_E.13(RF5) ; also sheet 5
BETA_5V: IO_C.8(VDD) IO_E.8(VDD) IO_W.8(VDD) RN8.3 RN8.4 RN9.3 RN9.4 RN10.3 RN10.4 RN11.3 RN11.4 RN12.3 RN12.4 U27.3(VDD) U28.3(VDD) ; also sheet 7,8,9,12,13,14
BETA_!FAULT: PC_E.24(RA3/CR) ; also sheet 9
BETA_!SHDN: PC_E.23(RA2/CD) ; also sheet 9
BTN: PC_W.26(RA5) ; also sheet 6
C_RA0: PC_C.21(RA0/C)
C_RA1: PC_C.22(RA1/C)
C_RA4: PC_C.25(RA4)
C_RA5: PC_C.26(RA5)
C_RA6: PC_C.33(RA6/O)
C_RA7: PC_C.32(RA7/O)
C_RB0: PC_C.8(RB0/CZ)
C_RC0: PC_C.34(RC0/O)
C_RC1: PC_C.35(RC1/O)
C_RC7: PC_C.1(RC7)
C_RD7: PC_C.5(RD7)
C_RE0: PC_C.27(RE0)
C_RE1: PC_C.28(RE1)
C_RE2: PC_C.29(RE2)
CNW_EN: PC_W.22(RA1/C) ; also sheet 11
CSE_EN: PC_E.15(RF7) ; also sheet 11
E_B_SCL: PC_E.47(RC5) ; also sheet 5
E_B_SDA: PC_E.48(RC6) ; also sheet 5
E_I2C_EN: PC_E.36(RF0) ; also sheet 11
E_RA4: PC_E.25(RA4)
E_RC2: PC_E.40(RC2) R19.1
E_RD2: PC_E.44(RD2)
E_RD3: PC_E.45(RD3)
E_RD4: PC_E.2(RD4)
E_RE0: PC_E.27(RE0)
E_RE1: PC_E.28(RE1)
E_RF1: PC_E.37(RF1)
E_RF2: PC_E.38(RF2)
E_RF3: PC_E.39(RF3)
E_SPI_EN: PC_E.34(RC0/O) ; also sheet 11
E_VE: PC_E.1(RC7) ; also sheet 11,14
E_VE_OV: U28.13(GP4) ; also sheet 5
E_VE_UV: U28.12(GP3) ; also sheet 5
EN_A: IO_W.16(GPA1) ; also sheet 12
EN_B: IO_W.18(GPA3) ; also sheet 12
EN_C: IO_W.20(GPA5) ; also sheet 12
EN_D: IO_W.22(GPA7) ; also sheet 12
EN_E: IO_W.1(GPB1) ; also sheet 12
EN_F: IO_W.3(GPB3) ; also sheet 12
EN_G: IO_W.5(GPB5) ; also sheet 12
EN_H: IO_W.7(GPB7) ; also sheet 12
EN_I: IO_E.1(GPB1) ; also sheet 13
EN_J: IO_E.3(GPB3) ; also sheet 13
EN_K: IO_E.5(GPB5) ; also sheet 13
EN_L: IO_E.7(GPB7) ; also sheet 13
EN_M: IO_C.16(GPA1) ; also sheet 13
EN_N: IO_C.18(GPA3) ; also sheet 13
EN_O: IO_C.20(GPA5) ; also sheet 13
EN_P: IO_C.22(GPA7) ; also sheet 13
EN_Q: IO_C.1(GPB1) ; also sheet 14
EN_R: IO_C.3(GPB3) ; also sheet 14
EN_S: IO_C.5(GPB5) ; also sheet 14
EN_T: IO_C.7(GPB7) ; also sheet 14
EN_U: IO_E.16(GPA1) ; also sheet 14
EN_V: IO_E.18(GPA3) ; also sheet 14
EN_W: IO_E.20(GPA5) ; also sheet 14
EN_X: IO_E.22(GPA7) ; also sheet 14
GND: D1.2 D2.2 IO_C.11(ADDR) IO_C.23(VSS) IO_C.25(VSS) IO_E.11(ADDR) IO_E.23(VSS) IO_E.25(VSS) IO_W.11(ADDR) IO_W.23(VSS) IO_W.25(VSS) PC_C.6(GND) PC_C.31(GND) PC_C.EP(GND) PC_E.6(GND) PC_E.31(GND) PC_E.EP(GND) PC_W.6(GND) PC_W.31(GND) PC_W.EP(GND) U27.1(GND) U27.6(ADDR) U27.EP(GND) U28.1(GND) U28.6(ADDR) U28.EP(GND) ; also sheet 2,3,5,6,7,8,9,11,12,13,14
IOC_!RST: IO_C.12(!RESET) PC_C.46(RC4/S)
IOC_INT: IO_C.13(INTB) PC_C.40(RC2)
IOC_SCL: IO_C.9(SCL) PC_C.45(RD3) RN9.2
IOC_SDA: IO_C.10(SDA) PC_C.44(RD2) RN9.1
IOE_!RST: IO_E.12(!RESET) PC_C.23(RA2/CD)
IOE_INT: IO_E.13(INTB) PC_C.24(RA3/CR)
IOE_SCL: IO_E.9(SCL) RN12.2
IOE_SDA: IO_E.10(SDA) RN12.1
IONW_SCL: PC_W.43(S/RD1) RN10.2 U27.4(SCL)
IONW_SDA: PC_W.42(S/RD0) RN10.1 U27.5(SDA)
IOSE_SCL: PC_E.17(RB5) RN11.1 U28.4(SCL)
IOSE_SDA: PC_E.16(RB4) RN11.2 U28.5(SDA)
IOW_!RST: IO_W.12(!RESET) PC_W.41(RC3/S)
IOW_INT: IO_W.13(INTB) PC_W.40(RC2)
IOW_SCL: IO_W.9(SCL) PC_W.45(RD3) RN8.2
IOW_SDA: IO_W.10(SDA) PC_W.44(RD2) RN8.1
JTAG_EN: PC_W.10(RB2/S) ; also sheet 11
N$28: D1.1 R18.2
N$29: D2.1 R19.2
N_CHK_V: PC_W.23(RA2/CD) ; also sheet 5,11
N_I2C_EN: PC_E.33(RA6/O) ; also sheet 11
N_SPI_EN: PC_E.35(RC1/O) ; also sheet 11
N_VE_OV: U27.14(GP5) ; also sheet 5
N_VE_RS: PC_W.27(RE0) ; also sheet 5
N_VE_UV: U27.9(GP0) ; also sheet 5
N_VN_OV: U27.15(GP6) ; also sheet 5
N_VN_RS: PC_W.29(RE2) ; also sheet 5
N_VN_UV: U27.10(GP1) ; also sheet 5
N_VW_OV: U27.16(GP7) ; also sheet 5
N_VW_RS: PC_W.28(RE1) ; also sheet 5
N_VW_UV: U27.11(GP2) ; also sheet 5
NW_!LDAC: PC_W.33(RA6/O) ; also sheet 7
NW_!RST: PC_W.35(RC1/O) U27.7(!RESET)
NW_INT: PC_W.34(RC0/O) U27.8(INT)
OS2: PC_E.26(RA5) ; also sheet 7
OS3: PC_W.13(RF5) ; also sheet 7
PCC_!MCLR: PC_C.20(P/RE3) PC_E.41(RC3/S)
PCC_PCLK: PC_C.18(RB6/P) PC_E.43(S/RD1)
PCC_PDAT: PC_C.19(RB7/PD) PC_E.42(S/RD0)
PCE_!MCLR: PC_E.20(P/RE3) ; also sheet 6
PCE_PCLK: PC_E.18(RB6/P) ; also sheet 6
PCE_PDAT: PC_E.19(RB7/PD) ; also sheet 6
PCIE_I2C_EN: PC_W.1(RC7) ; also sheet 11
PCIE_NIO_EN: PC_W.21(RA0/C) ; also sheet 9
PCIE_SIO_EN: PC_W.14(RF6) ; also sheet 9
PCW_!MCLR: PC_C.41(RC3/S) PC_W.20(P/RE3)
PCW_PCLK: PC_C.43(S/RD1) PC_W.18(RB6/P)
PCW_PDAT: PC_C.42(S/RD0) PC_W.19(RB7/PD)
PG_A: IO_W.15(GPA0) ; also sheet 12
PG_B: IO_W.17(GPA2) ; also sheet 12
PG_C: IO_W.19(GPA4) ; also sheet 12
PG_D: IO_W.21(GPA6) ; also sheet 12
PG_E: IO_W.24(GPB0) ; also sheet 12
PG_F: IO_W.2(GPB2) ; also sheet 12
PG_G: IO_W.4(GPB4) ; also sheet 12
PG_H: IO_W.6(GPB6) ; also sheet 12
PG_I: IO_E.24(GPB0) ; also sheet 13
PG_J: IO_E.2(GPB2) ; also sheet 13
PG_K: IO_E.4(GPB4) ; also sheet 13
PG_L: IO_E.6(GPB6) ; also sheet 13
PG_M: IO_C.15(GPA0) ; also sheet 13
PG_N: IO_C.17(GPA2) ; also sheet 13
PG_O: IO_C.19(GPA4) ; also sheet 13
PG_P: IO_C.21(GPA6) ; also sheet 13
PG_Q: IO_C.24(GPB0) ; also sheet 14
PG_R: IO_C.2(GPB2) ; also sheet 14
PG_S: IO_C.4(GPB4) ; also sheet 14
PG_T: IO_C.6(GPB6) ; also sheet 14
PG_U: IO_E.15(GPA0) ; also sheet 14
PG_V: IO_E.17(GPA2) ; also sheet 14
PG_W: IO_E.19(GPA4) ; also sheet 14
PG_X: IO_E.21(GPA6) ; also sheet 14
S_CHK_V: PC_E.14(RF6) ; also sheet 5,11
S_I2C_EN: PC_W.9(RB1/CS) ; also sheet 11
S_SPI_EN: PC_W.11(RB3/C) ; also sheet 11
S_VE_OV: U28.16(GP7) ; also sheet 5
S_VE_RS: PC_E.4(RD6) ; also sheet 5
S_VE_UV: U28.11(GP2) ; also sheet 5
S_VS_OV: U28.15(GP6) ; also sheet 5
S_VS_RS: PC_E.5(RD7) ; also sheet 5
S_VS_UV: U28.10(GP1) ; also sheet 5
S_VW_OV: U28.14(GP5) ; also sheet 5
S_VW_RS: PC_E.3(RD5) ; also sheet 5
S_VW_UV: U28.9(GP0) ; also sheet 5
SCK1: PC_W.46(RC4/S) ; also sheet 12
SCK2: PC_C.9(RB1/CS) ; also sheet 13
SCK3: PC_C.4(RD6) ; also sheet 14
SCL1: PC_W.5(RD7) ; also sheet 7,12
SCL2: PC_C.16(RB4) ; also sheet 7,13
SCL3: PC_C.48(RC6) ; also sheet 7,14
SCL4: PC_E.8(RB0/CZ) ; also sheet 7,9
SD_V_EN: PC_E.29(RE2) ; also sheet 11
SDA1: PC_W.4(RD6) ; also sheet 7,12
SDA2: PC_C.17(RB5) ; also sheet 7,13
SDA3: PC_C.47(RC5) ; also sheet 7,14
SDA4: PC_E.9(RB1/CS) ; also sheet 7,9
SDI1: PC_W.48(RC6) ; also sheet 12
SDI2: PC_C.10(RB2/S) ; also sheet 13
SDI3: PC_C.3(RD5) ; also sheet 14
SDO1: PC_W.47(RC5) ; also sheet 12
SDO2: PC_C.11(RB3/C) ; also sheet 13
SDO3: PC_C.2(RD4) ; also sheet 14
SE_!LDAC: PC_E.10(RB2/S) ; also sheet 7
SE_!RST: PC_E.12(RF4) U28.7(!RESET)
SE_INT: PC_E.11(RB3/C) U28.8(INT)
UNUSED_EN: PC_W.8(RB0/CZ) ; also sheet 11
VCC_EN: PC_E.32(RA7/O) ; also sheet 11
VPC: PC_C.7(VCC) PC_C.30(VCC) PC_E.7(VCC) PC_E.30(VCC) PC_W.7(VCC) PC_W.30(VCC) ; also sheet 5,8,9
W_A_SCL: PC_W.2(RD4) ; also sheet 5
W_A_SDA: PC_W.3(RD5) ; also sheet 5
W_I2C_EN: PC_W.12(RF4) ; also sheet 11
W_RA7: PC_W.32(RA7/O)
W_RB4: PC_W.16(RB4)
W_RB5: PC_W.17(RB5) R18.1
W_RF7: PC_W.15(RF7)
W_VW: PC_W.24(RA3/CR) ; also sheet 11,13
W_VW_OV: U27.13(GP4) ; also sheet 5
W_VW_UV: U27.12(GP3) ; also sheet 5
ZED_!FAULT: PC_E.22(RA1/C) ; also sheet 9
ZED_!SHDN: PC_E.21(RA0/C) ; also sheet 9
ZED_TCK: ZED.1(_JTAG:TCK) ; also sheet 6
ZED_TDI: ZED.4(_JTAG:TDI) ; also sheet 6
ZED_TDO: ZED.3(_JTAG:TDO) ; also sheet 6
ZED_TMS: ZED.2(_JTAG:TMS) ; also sheet 6
Unconnected: IO_C.14(INTA) IO_E.14(INTA) IO_W.14(INTA)

### Notes on the sheet
- AXIOM Beta Power Board
- Interface Power and Control
- Copyright (C) 2014-2017 H.Poetzl
  Licensed under CERN OHL v.1.2

## Sheet 11 of 14
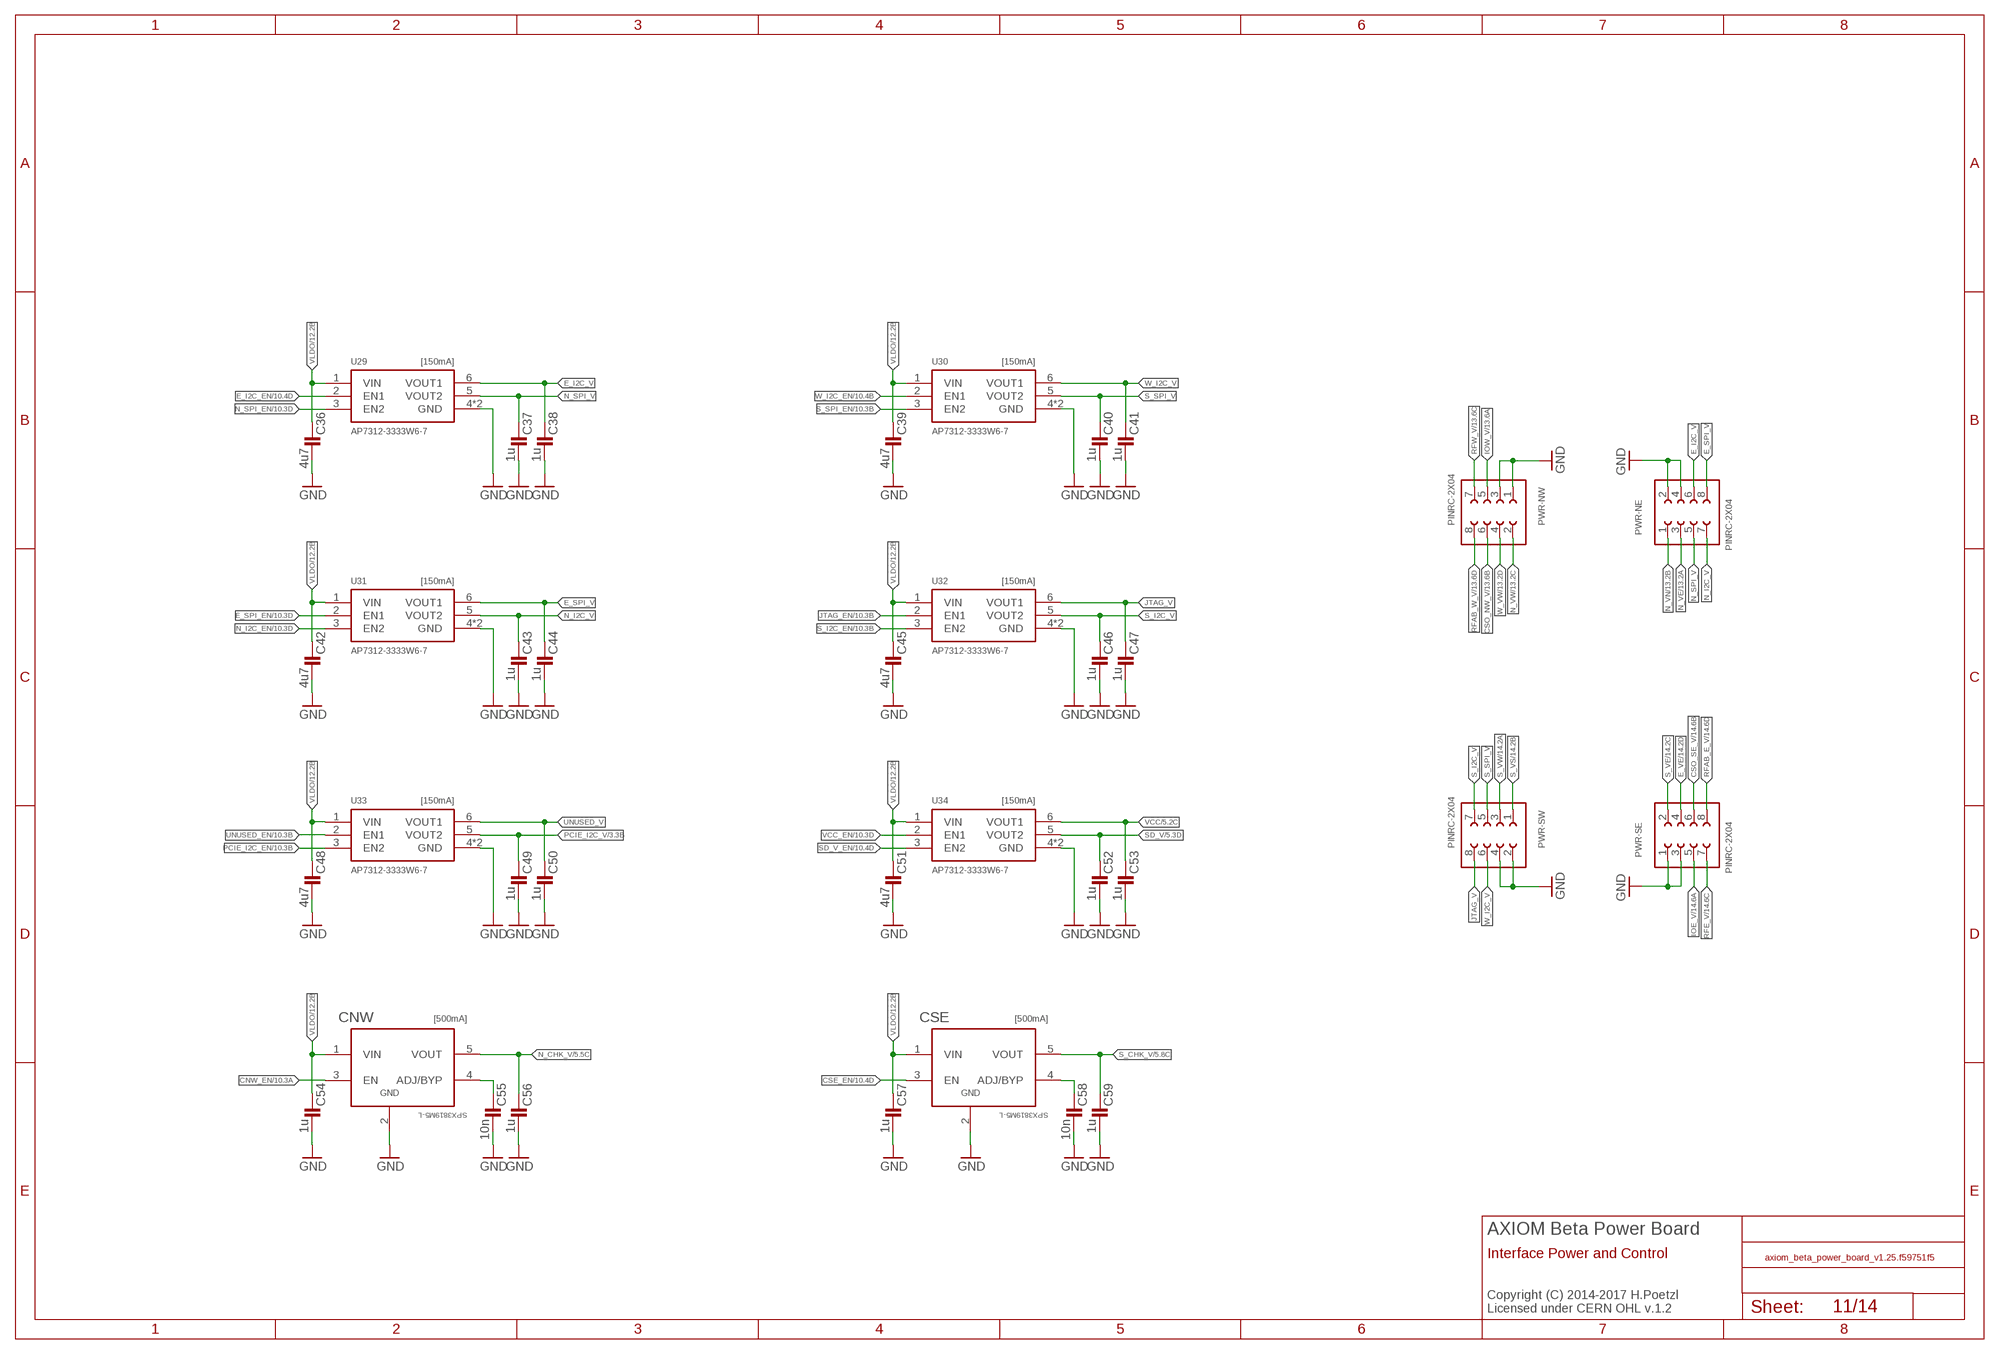
[diagram p10: schematic, sheet 11]

### Parts
C36  4u7  C0603-C  [0603-C]
C37  1u  C0402-C  [0402-C]
C38  1u  C0402-C  [0402-C]
C39  4u7  C0603-C  [0603-C]
C40  1u  C0402-C  [0402-C]
C41  1u  C0402-C  [0402-C]
C42  4u7  C0603-C  [0603-C]
C43  1u  C0402-C  [0402-C]
C44  1u  C0402-C  [0402-C]
C45  4u7  C0603-C  [0603-C]
C46  1u  C0402-C  [0402-C]
C47  1u  C0402-C  [0402-C]
C48  4u7  C0603-C  [0603-C]
C49  1u  C0402-C  [0402-C]
C50  1u  C0402-C  [0402-C]
C51  4u7  C0603-C  [0603-C]
C52  1u  C0402-C  [0402-C]
C53  1u  C0402-C  [0402-C]
C54  1u  C0402-B  [0402-B]
C55  10n  C0402-B  [0402-B]
C56  1u  C0402-B  [0402-B]
C57  1u  C0402-B  [0402-B]
C58  10n  C0402-B  [0402-B]
C59  1u  C0402-B  [0402-B]
CNW  SPX3819M5-L  [SOT95P280X145-5N]
CSE  SPX3819M5-L  [SOT95P280X145-5N]
PWR-NE  PINRC-2X04  [R2X04]  (not fitted in variant Beta)  (not fitted in variant Min)
PWR-NW  PINRC-2X04  [R2X04]  (not fitted in variant Beta)  (not fitted in variant Min)
PWR-SE  PINRC-2X04  [R2X04]  (not fitted in variant Beta)  (not fitted in variant Min)
PWR-SW  PINRC-2X04  [R2X04]  (not fitted in variant Beta)  (not fitted in variant Min)
U29  AP7312-3333W6-7  LDO_DUAL  [DFN2018-6]
U30  AP7312-3333W6-7  LDO_DUAL  [DFN2018-6]
U31  AP7312-3333W6-7  LDO_DUAL  [DFN2018-6]
U32  AP7312-3333W6-7  LDO_DUAL  [DFN2018-6]
U33  AP7312-3333W6-7  LDO_DUAL  [DFN2018-6]
U34  AP7312-3333W6-7  LDO_DUAL  [DFN2018-6]

### Nets
CNW_EN: CNW.3(EN) ; also sheet 10
CNW_PG: C55.1 CNW.4(ADJ/BYP)
CSE_EN: CSE.3(EN) ; also sheet 10
CSE_PG: C58.1 CSE.4(ADJ/BYP)
CSO_NW_V: PWR-NW.6 ; also sheet 13
CSO_SE_V: PWR-SE.6 ; also sheet 14
E_I2C_EN: U29.2(EN1) ; also sheet 10
E_I2C_V: C38.1 PWR-NE.6 U29.6(VOUT1)
E_SPI_EN: U31.2(EN1) ; also sheet 10
E_SPI_V: C44.1 PWR-NE.8 U31.6(VOUT1)
E_VE: PWR-SE.4 ; also sheet 10,14
GND: C36.2 C37.2 C38.2 C39.2 C40.2 C41.2 C42.2 C43.2 C44.2 C45.2 C46.2 C47.2 C48.2 C49.2 C50.2 C51.2 C52.2 C53.2 C54.2 C55.2 C56.2 C57.2 C58.2 C59.2 CNW.2(GND) CSE.2(GND) PWR-NE.2 PWR-NE.4 PWR-NW.1 PWR-NW.3 PWR-SE.1 PWR-SE.3 PWR-SW.2 PWR-SW.4 U29.4(GND) U29.10(GND) U30.4(GND) U30.10(GND) U31.4(GND) U31.10(GND) U32.4(GND) U32.10(GND) U33.4(GND) U33.10(GND) U34.4(GND) U34.10(GND) ; also sheet 2,3,5,6,7,8,9,10,12,13,14
IOE_V: PWR-SE.5 ; also sheet 5,14
IOW_V: PWR-NW.5 ; also sheet 5,13
JTAG_EN: U32.2(EN1) ; also sheet 10
JTAG_V: C47.1 PWR-SW.8 U32.6(VOUT1)
N_CHK_V: C56.1 CNW.5(VOUT) ; also sheet 5,10
N_I2C_EN: U31.3(EN2) ; also sheet 10
N_I2C_V: C43.1 PWR-NE.7 U31.5(VOUT2)
N_SPI_EN: U29.3(EN2) ; also sheet 10
N_SPI_V: C37.1 PWR-NE.5 U29.5(VOUT2)
N_VE: PWR-NE.3 ; also sheet 13
N_VN: PWR-NE.1 ; also sheet 13
N_VW: PWR-NW.2 ; also sheet 13
PCIE_I2C_EN: U33.3(EN2) ; also sheet 10
PCIE_I2C_V: C49.1 U33.5(VOUT2) ; also sheet 3
RFAB_E_V: PWR-SE.8 ; also sheet 14
RFAB_W_V: PWR-NW.8 ; also sheet 13
RFE_V: PWR-SE.7 ; also sheet 14
RFW_V: PWR-NW.7 ; also sheet 13
S_CHK_V: C59.1 CSE.5(VOUT) ; also sheet 5,10
S_I2C_EN: U32.3(EN2) ; also sheet 10
S_I2C_V: C46.1 PWR-SW.7 U32.5(VOUT2)
S_SPI_EN: U30.3(EN2) ; also sheet 10
S_SPI_V: C40.1 PWR-SW.5 U30.5(VOUT2)
S_VE: PWR-SE.2 ; also sheet 14
S_VS: PWR-SW.1 ; also sheet 14
S_VW: PWR-SW.3 ; also sheet 14
SD_V: C52.1 U34.5(VOUT2) ; also sheet 5
SD_V_EN: U34.3(EN2) ; also sheet 10
UNUSED_EN: U33.2(EN1) ; also sheet 10
UNUSED_V: C50.1 U33.6(VOUT1)
VCC: C53.1 U34.6(VOUT1) ; also sheet 5,6
VCC_EN: U34.2(EN1) ; also sheet 10
VLDO: C36.1 C39.1 C42.1 C45.1 C48.1 C51.1 C54.1 C57.1 CNW.1(VIN) CSE.1(VIN) U29.1(VIN) U30.1(VIN) U31.1(VIN) U32.1(VIN) U33.1(VIN) U34.1(VIN) ; also sheet 12
W_I2C_EN: U30.2(EN1) ; also sheet 10
W_I2C_V: C41.1 PWR-SW.6 U30.6(VOUT1)
W_VW: PWR-NW.4 ; also sheet 10,13

### Notes on the sheet
- [150mA] | [150mA]
- [150mA] | [150mA]
- [150mA] | [150mA]
- [500mA] | [500mA]
- AXIOM Beta Power Board
- Interface Power and Control
- Copyright (C) 2014-2017 H.Poetzl
  Licensed under CERN OHL v.1.2

## Sheet 12 of 14
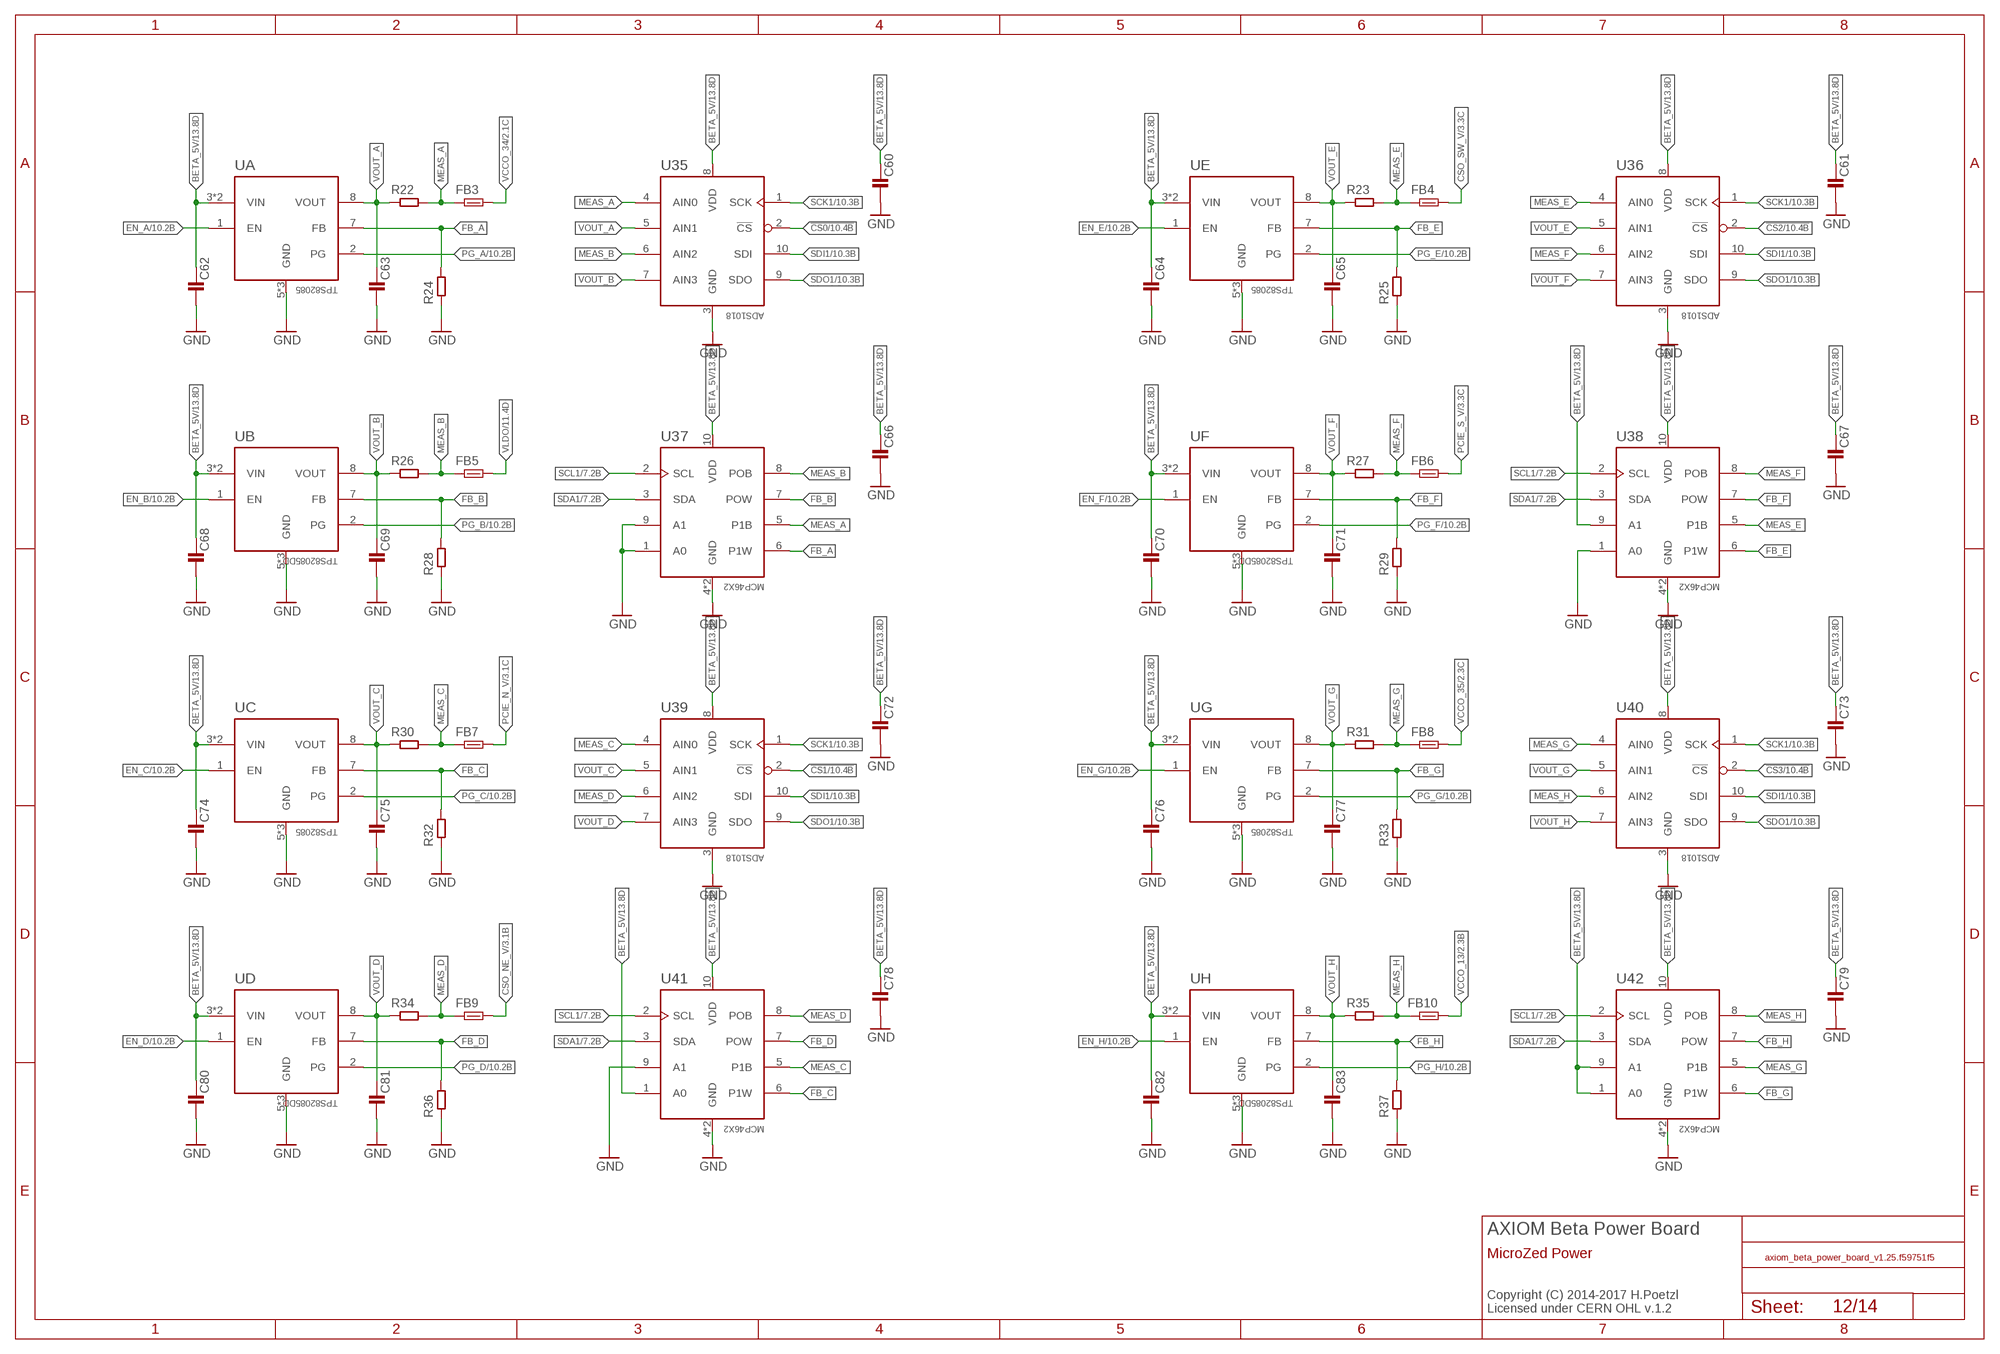
[diagram p11: schematic, sheet 12]

### Parts
C60  C0402-C  [0402-C]
C61  C0402-C  [0402-C]
C62  C0603-C  [0603-C]
C63  C0603-C  [0603-C]
C64  C0603-C  [0603-C]
C65  C0603-C  [0603-C]
C66  C0402-C  [0402-C]
C67  C0402-C  [0402-C]
C68  C0603-C  [0603-C]
C69  C0603-C  [0603-C]
C70  C0603-C  [0603-C]
C71  C0603-C  [0603-C]
C72  C0402-C  [0402-C]
C73  C0402-C  [0402-C]
C74  C0603-C  [0603-C]
C75  C0603-C  [0603-C]
C76  C0603-C  [0603-C]
C77  C0603-C  [0603-C]
C78  C0402-C  [0402-C]
C79  C0402-C  [0402-C]
C80  C0603-C  [0603-C]
C81  C0603-C  [0603-C]
C82  C0603-C  [0603-C]
C83  C0603-C  [0603-C]
FB3  FB0603-C  [0603-C]
FB4  FB0603-C  [0603-C]
FB5  FB0603-C  [0603-C]
FB6  FB0603-C  [0603-C]
FB7  FB0603-C  [0603-C]
FB8  FB0603-C  [0603-C]
FB9  FB0603-C  [0603-C]
FB10  FB0603-C  [0603-C]
R22  R0603-C  [0603-C]
R23  R0603-C  [0603-C]
R24  R0402-C  [0402-C]
R25  R0402-C  [0402-C]
R26  R0603-C  [0603-C]
R27  R0603-C  [0603-C]
R28  R0402-C  [0402-C]
R29  R0402-C  [0402-C]
R30  R0603-C  [0603-C]
R31  R0603-C  [0603-C]
R32  R0402-C  [0402-C]
R33  R0402-C  [0402-C]
R34  R0603-C  [0603-C]
R35  R0603-C  [0603-C]
R36  R0402-C  [0402-C]
R37  R0402-C  [0402-C]
U35  ADS1018  [X2QFN-10]
U36  ADS1018  [X2QFN-10]
U37  MCP46X2  [DFN-10]
U38  MCP46X2  [DFN-10]
U39  ADS1018  [X2QFN-10]
U40  ADS1018  [X2QFN-10]
U41  MCP46X2  [DFN-10]
U42  MCP46X2  [DFN-10]
UA  TPS82085  [MICROSIP]
UB  TPS82085DD  [MICROSIP-DD]
UC  TPS82085  [MICROSIP]
UD  TPS82085DD  [MICROSIP-DD]
UE  TPS82085  [MICROSIP]
UF  TPS82085DD  [MICROSIP-DD]
UG  TPS82085  [MICROSIP]
UH  TPS82085DD  [MICROSIP-DD]

### Nets
!CS0: U35.2(!CS) ; also sheet 10
!CS1: U39.2(!CS) ; also sheet 10
!CS2: U36.2(!CS) ; also sheet 10
!CS3: U40.2(!CS) ; also sheet 10
BETA_5V: C60.1 C61.1 C62.1 C64.1 C66.1 C67.1 C68.1 C70.1 C72.1 C73.1 C74.1 C76.1 C78.1 C79.1 C80.1 C82.1 U35.8(VDD) U36.8(VDD) U37.10(VDD) U38.9(A1) U38.10(VDD) U39.8(VDD) U40.8(VDD) U41.1(A0) U41.10(VDD) U42.1(A0) U42.9(A1) U42.10(VDD) UA.3(VIN) UA.4(VIN) UB.3(VIN) UB.4(VIN) UC.3(VIN) UC.4(VIN) UD.3(VIN) UD.4(VIN) UE.3(VIN) UE.4(VIN) UF.3(VIN) UF.4(VIN) UG.3(VIN) UG.4(VIN) UH.3(VIN) UH.4(VIN) ; also sheet 7,8,9,10,13,14
CSO_NE_V: FB9.2 ; also sheet 3
CSO_SW_V: FB4.2 ; also sheet 3
EN_A: UA.1(EN) ; also sheet 10
EN_B: UB.1(EN) ; also sheet 10
EN_C: UC.1(EN) ; also sheet 10
EN_D: UD.1(EN) ; also sheet 10
EN_E: UE.1(EN) ; also sheet 10
EN_F: UF.1(EN) ; also sheet 10
EN_G: UG.1(EN) ; also sheet 10
EN_H: UH.1(EN) ; also sheet 10
FB_A: R24.2 U37.6(P1W) UA.7(FB)
FB_B: R28.2 U37.7(POW) UB.7(FB)
FB_C: R32.2 U41.6(P1W) UC.7(FB)
FB_D: R36.2 U41.7(POW) UD.7(FB)
FB_E: R25.2 U38.6(P1W) UE.7(FB)
FB_F: R29.2 U38.7(POW) UF.7(FB)
FB_G: R33.2 U42.6(P1W) UG.7(FB)
FB_H: R37.2 U42.7(POW) UH.7(FB)
GND: C60.2 C61.2 C62.2 C63.2 C64.2 C65.2 C66.2 C67.2 C68.2 C69.2 C70.2 C71.2 C72.2 C73.2 C74.2 C75.2 C76.2 C77.2 C78.2 C79.2 C80.2 C81.2 C82.2 C83.2 R24.1 R25.1 R28.1 R29.1 R32.1 R33.1 R36.1 R37.1 U35.3(GND) U36.3(GND) U37.1(A0) U37.4(GND) U37.9(A1) U37.EP(GND) U38.1(A0) U38.4(GND) U38.EP(GND) U39.3(GND) U40.3(GND) U41.4(GND) U41.9(A1) U41.EP(GND) U42.4(GND) U42.EP(GND) UA.5(GND) UA.6(GND) UA.EP(GND) UB.5(GND) UB.6(GND) UB.EP(GND) UC.5(GND) UC.6(GND) UC.EP(GND) UD.5(GND) UD.6(GND) UD.EP(GND) UE.5(GND) UE.6(GND) UE.EP(GND) UF.5(GND) UF.6(GND) UF.EP(GND) UG.5(GND) UG.6(GND) UG.EP(GND) UH.5(GND) UH.6(GND) UH.EP(GND) ; also sheet 2,3,5,6,7,8,9,10,11,13,14
MEAS_A: FB3.1 R22.2 U35.4(AIN0) U37.5(P1B)
MEAS_B: FB5.1 R26.2 U35.6(AIN2) U37.8(POB)
MEAS_C: FB7.1 R30.2 U39.4(AIN0) U41.5(P1B)
MEAS_D: FB9.1 R34.2 U39.6(AIN2) U41.8(POB)
MEAS_E: FB4.1 R23.2 U36.4(AIN0) U38.5(P1B)
MEAS_F: FB6.1 R27.2 U36.6(AIN2) U38.8(POB)
MEAS_G: FB8.1 R31.2 U40.4(AIN0) U42.5(P1B)
MEAS_H: FB10.1 R35.2 U40.6(AIN2) U42.8(POB)
PCIE_N_V: FB7.2 ; also sheet 3
PCIE_S_V: FB6.2 ; also sheet 3
PG_A: UA.2(PG) ; also sheet 10
PG_B: UB.2(PG) ; also sheet 10
PG_C: UC.2(PG) ; also sheet 10
PG_D: UD.2(PG) ; also sheet 10
PG_E: UE.2(PG) ; also sheet 10
PG_F: UF.2(PG) ; also sheet 10
PG_G: UG.2(PG) ; also sheet 10
PG_H: UH.2(PG) ; also sheet 10
SCK1: U35.1(SCK) U36.1(SCK) U39.1(SCK) U40.1(SCK) ; also sheet 10
SCL1: U37.2(SCL) U38.2(SCL) U41.2(SCL) U42.2(SCL) ; also sheet 7,10
SDA1: U37.3(SDA) U38.3(SDA) U41.3(SDA) U42.3(SDA) ; also sheet 7,10
SDI1: U35.10(SDI) U36.10(SDI) U39.10(SDI) U40.10(SDI) ; also sheet 10
SDO1: U35.9(SDO) U36.9(SDO) U39.9(SDO) U40.9(SDO) ; also sheet 10
VCCO_13 [LVDS]: FB10.2 ; also sheet 2
VCCO_34: FB3.2 ; also sheet 2,6,9
VCCO_35: FB8.2 ; also sheet 2,6,9
VLDO: FB5.2 ; also sheet 11
VOUT_A: C63.1 R22.1 U35.5(AIN1) UA.8(VOUT)
VOUT_B: C69.1 R26.1 U35.7(AIN3) UB.8(VOUT)
VOUT_C: C75.1 R30.1 U39.5(AIN1) UC.8(VOUT)
VOUT_D: C81.1 R34.1 U39.7(AIN3) UD.8(VOUT)
VOUT_E: C65.1 R23.1 U36.5(AIN1) UE.8(VOUT)
VOUT_F: C71.1 R27.1 U36.7(AIN3) UF.8(VOUT)
VOUT_G: C77.1 R31.1 U40.5(AIN1) UG.8(VOUT)
VOUT_H: C83.1 R35.1 U40.7(AIN3) UH.8(VOUT)

### Notes on the sheet
- AXIOM Beta Power Board
- MicroZed Power
- Copyright (C) 2014-2017 H.Poetzl
  Licensed under CERN OHL v.1.2

## Sheet 13 of 14
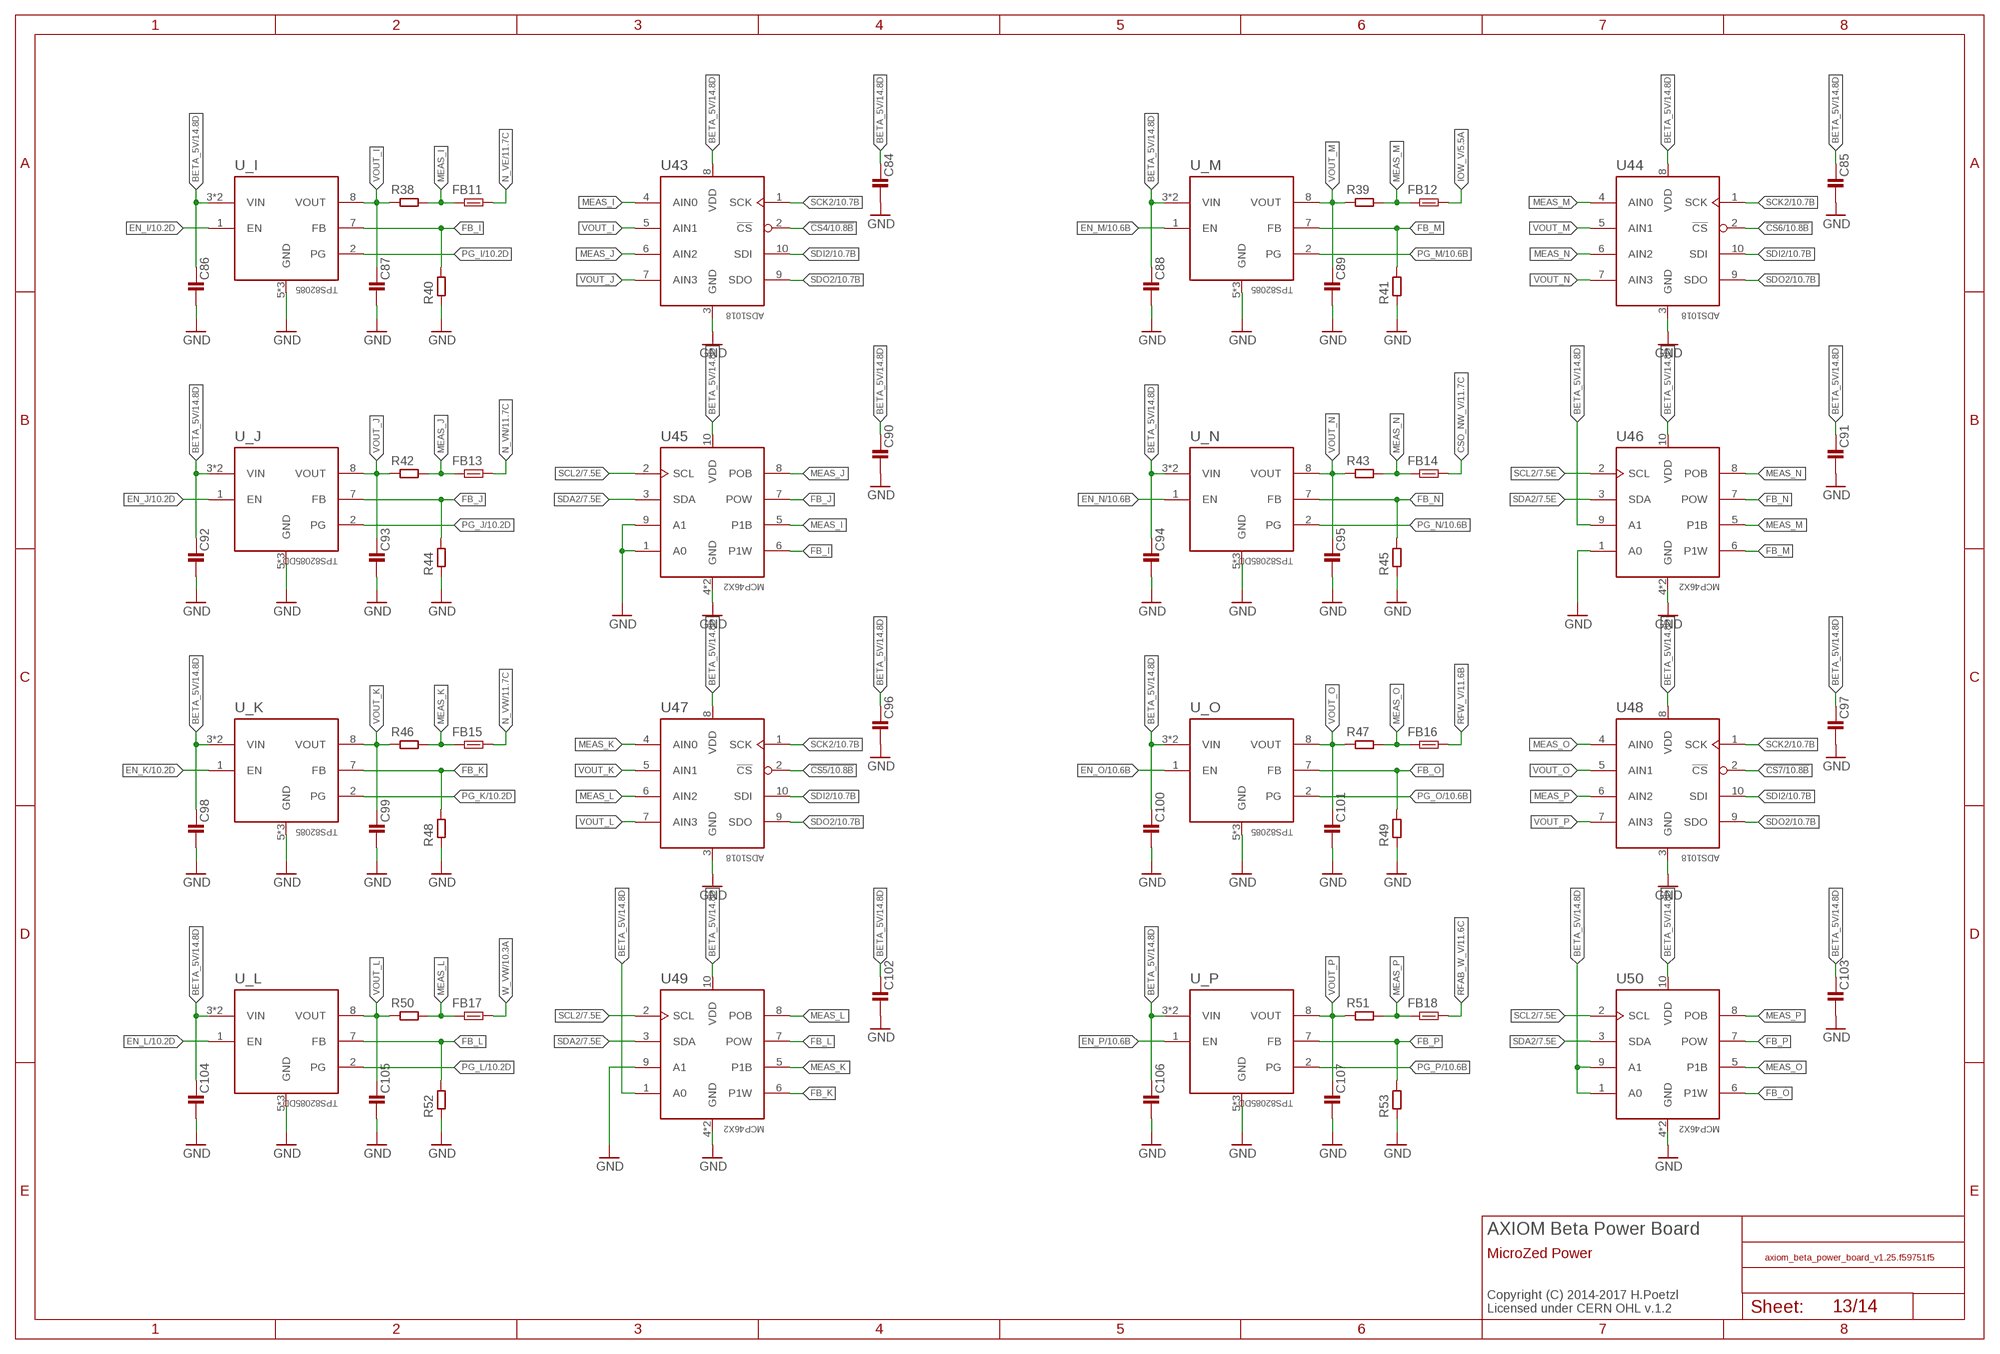
[diagram p12: schematic, sheet 13]

### Parts
C84  C0402-C  [0402-C]
C85  C0402-C  [0402-C]
C86  C0603-C  [0603-C]
C87  C0603-C  [0603-C]
C88  C0603-C  [0603-C]
C89  C0603-C  [0603-C]
C90  C0402-C  [0402-C]
C91  C0402-C  [0402-C]
C92  C0603-C  [0603-C]
C93  C0603-C  [0603-C]
C94  C0603-C  [0603-C]
C95  C0603-C  [0603-C]
C96  C0402-C  [0402-C]
C97  C0402-C  [0402-C]
C98  C0603-C  [0603-C]
C99  C0603-C  [0603-C]
C100  C0603-C  [0603-C]
C101  C0603-C  [0603-C]
C102  C0402-C  [0402-C]
C103  C0402-C  [0402-C]
C104  C0603-C  [0603-C]
C105  C0603-C  [0603-C]
C106  C0603-C  [0603-C]
C107  C0603-C  [0603-C]
FB11  FB0603-C  [0603-C]
FB12  FB0603-C  [0603-C]
FB13  FB0603-C  [0603-C]
FB14  FB0603-C  [0603-C]
FB15  FB0603-C  [0603-C]
FB16  FB0603-C  [0603-C]
FB17  FB0603-C  [0603-C]
FB18  FB0603-C  [0603-C]
R38  R0603-C  [0603-C]
R39  R0603-C  [0603-C]
R40  R0402-C  [0402-C]
R41  R0402-C  [0402-C]
R42  R0603-C  [0603-C]
R43  R0603-C  [0603-C]
R44  R0402-C  [0402-C]
R45  R0402-C  [0402-C]
R46  R0603-C  [0603-C]
R47  R0603-C  [0603-C]
R48  R0402-C  [0402-C]
R49  R0402-C  [0402-C]
R50  R0603-C  [0603-C]
R51  R0603-C  [0603-C]
R52  R0402-C  [0402-C]
R53  R0402-C  [0402-C]
U43  ADS1018  [X2QFN-10]
U44  ADS1018  [X2QFN-10]
U45  MCP46X2  [DFN-10]
U46  MCP46X2  [DFN-10]
U47  ADS1018  [X2QFN-10]
U48  ADS1018  [X2QFN-10]
U49  MCP46X2  [DFN-10]
U50  MCP46X2  [DFN-10]
U_I  TPS82085  [MICROSIP]
U_J  TPS82085DD  [MICROSIP-DD]
U_K  TPS82085  [MICROSIP]
U_L  TPS82085DD  [MICROSIP-DD]
U_M  TPS82085  [MICROSIP]
U_N  TPS82085DD  [MICROSIP-DD]
U_O  TPS82085  [MICROSIP]
U_P  TPS82085DD  [MICROSIP-DD]

### Nets
!CS4: U43.2(!CS) ; also sheet 10
!CS5: U47.2(!CS) ; also sheet 10
!CS6: U44.2(!CS) ; also sheet 10
!CS7: U48.2(!CS) ; also sheet 10
BETA_5V: C84.1 C85.1 C86.1 C88.1 C90.1 C91.1 C92.1 C94.1 C96.1 C97.1 C98.1 C100.1 C102.1 C103.1 C104.1 C106.1 U43.8(VDD) U44.8(VDD) U45.10(VDD) U46.9(A1) U46.10(VDD) U47.8(VDD) U48.8(VDD) U49.1(A0) U49.10(VDD) U50.1(A0) U50.9(A1) U50.10(VDD) U_I.3(VIN) U_I.4(VIN) U_J.3(VIN) U_J.4(VIN) U_K.3(VIN) U_K.4(VIN) U_L.3(VIN) U_L.4(VIN) U_M.3(VIN) U_M.4(VIN) U_N.3(VIN) U_N.4(VIN) U_O.3(VIN) U_O.4(VIN) U_P.3(VIN) U_P.4(VIN) ; also sheet 7,8,9,10,12,14
CSO_NW_V: FB14.2 ; also sheet 11
EN_I: U_I.1(EN) ; also sheet 10
EN_J: U_J.1(EN) ; also sheet 10
EN_K: U_K.1(EN) ; also sheet 10
EN_L: U_L.1(EN) ; also sheet 10
EN_M: U_M.1(EN) ; also sheet 10
EN_N: U_N.1(EN) ; also sheet 10
EN_O: U_O.1(EN) ; also sheet 10
EN_P: U_P.1(EN) ; also sheet 10
FB_I: R40.2 U45.6(P1W) U_I.7(FB)
FB_J: R44.2 U45.7(POW) U_J.7(FB)
FB_K: R48.2 U49.6(P1W) U_K.7(FB)
FB_L: R52.2 U49.7(POW) U_L.7(FB)
FB_M: R41.2 U46.6(P1W) U_M.7(FB)
FB_N: R45.2 U46.7(POW) U_N.7(FB)
FB_O: R49.2 U50.6(P1W) U_O.7(FB)
FB_P: R53.2 U50.7(POW) U_P.7(FB)
GND: C84.2 C85.2 C86.2 C87.2 C88.2 C89.2 C90.2 C91.2 C92.2 C93.2 C94.2 C95.2 C96.2 C97.2 C98.2 C99.2 C100.2 C101.2 C102.2 C103.2 C104.2 C105.2 C106.2 C107.2 R40.1 R41.1 R44.1 R45.1 R48.1 R49.1 R52.1 R53.1 U43.3(GND) U44.3(GND) U45.1(A0) U45.4(GND) U45.9(A1) U45.EP(GND) U46.1(A0) U46.4(GND) U46.EP(GND) U47.3(GND) U48.3(GND) U49.4(GND) U49.9(A1) U49.EP(GND) U50.4(GND) U50.EP(GND) U_I.5(GND) U_I.6(GND) U_I.EP(GND) U_J.5(GND) U_J.6(GND) U_J.EP(GND) U_K.5(GND) U_K.6(GND) U_K.EP(GND) U_L.5(GND) U_L.6(GND) U_L.EP(GND) U_M.5(GND) U_M.6(GND) U_M.EP(GND) U_N.5(GND) U_N.6(GND) U_N.EP(GND) U_O.5(GND) U_O.6(GND) U_O.EP(GND) U_P.5(GND) U_P.6(GND) U_P.EP(GND) ; also sheet 2,3,5,6,7,8,9,10,11,12,14
IOW_V: FB12.2 ; also sheet 5,11
MEAS_I: FB11.1 R38.2 U43.4(AIN0) U45.5(P1B)
MEAS_J: FB13.1 R42.2 U43.6(AIN2) U45.8(POB)
MEAS_K: FB15.1 R46.2 U47.4(AIN0) U49.5(P1B)
MEAS_L: FB17.1 R50.2 U47.6(AIN2) U49.8(POB)
MEAS_M: FB12.1 R39.2 U44.4(AIN0) U46.5(P1B)
MEAS_N: FB14.1 R43.2 U44.6(AIN2) U46.8(POB)
MEAS_O: FB16.1 R47.2 U48.4(AIN0) U50.5(P1B)
MEAS_P: FB18.1 R51.2 U48.6(AIN2) U50.8(POB)
N_VE: FB11.2 ; also sheet 11
N_VN: FB13.2 ; also sheet 11
N_VW: FB15.2 ; also sheet 11
PG_I: U_I.2(PG) ; also sheet 10
PG_J: U_J.2(PG) ; also sheet 10
PG_K: U_K.2(PG) ; also sheet 10
PG_L: U_L.2(PG) ; also sheet 10
PG_M: U_M.2(PG) ; also sheet 10
PG_N: U_N.2(PG) ; also sheet 10
PG_O: U_O.2(PG) ; also sheet 10
PG_P: U_P.2(PG) ; also sheet 10
RFAB_W_V: FB18.2 ; also sheet 11
RFW_V: FB16.2 ; also sheet 11
SCK2: U43.1(SCK) U44.1(SCK) U47.1(SCK) U48.1(SCK) ; also sheet 10
SCL2: U45.2(SCL) U46.2(SCL) U49.2(SCL) U50.2(SCL) ; also sheet 7,10
SDA2: U45.3(SDA) U46.3(SDA) U49.3(SDA) U50.3(SDA) ; also sheet 7,10
SDI2: U43.10(SDI) U44.10(SDI) U47.10(SDI) U48.10(SDI) ; also sheet 10
SDO2: U43.9(SDO) U44.9(SDO) U47.9(SDO) U48.9(SDO) ; also sheet 10
VOUT_I: C87.1 R38.1 U43.5(AIN1) U_I.8(VOUT)
VOUT_J: C93.1 R42.1 U43.7(AIN3) U_J.8(VOUT)
VOUT_K: C99.1 R46.1 U47.5(AIN1) U_K.8(VOUT)
VOUT_L: C105.1 R50.1 U47.7(AIN3) U_L.8(VOUT)
VOUT_M: C89.1 R39.1 U44.5(AIN1) U_M.8(VOUT)
VOUT_N: C95.1 R43.1 U44.7(AIN3) U_N.8(VOUT)
VOUT_O: C101.1 R47.1 U48.5(AIN1) U_O.8(VOUT)
VOUT_P: C107.1 R51.1 U48.7(AIN3) U_P.8(VOUT)
W_VW: FB17.2 ; also sheet 10,11

### Notes on the sheet
- AXIOM Beta Power Board
- MicroZed Power
- Copyright (C) 2014-2017 H.Poetzl
  Licensed under CERN OHL v.1.2